# EAGLE schematic Comms (EAGLE 9.6.2), part 1 of 2
DESIGNER: Bradley L. Davis; PART_NUMBER: 68-0003; PROJECT: CougSat-1: Comms; REV: 1.2.0
Assembly variants: Main

## Sheet 1 of 14
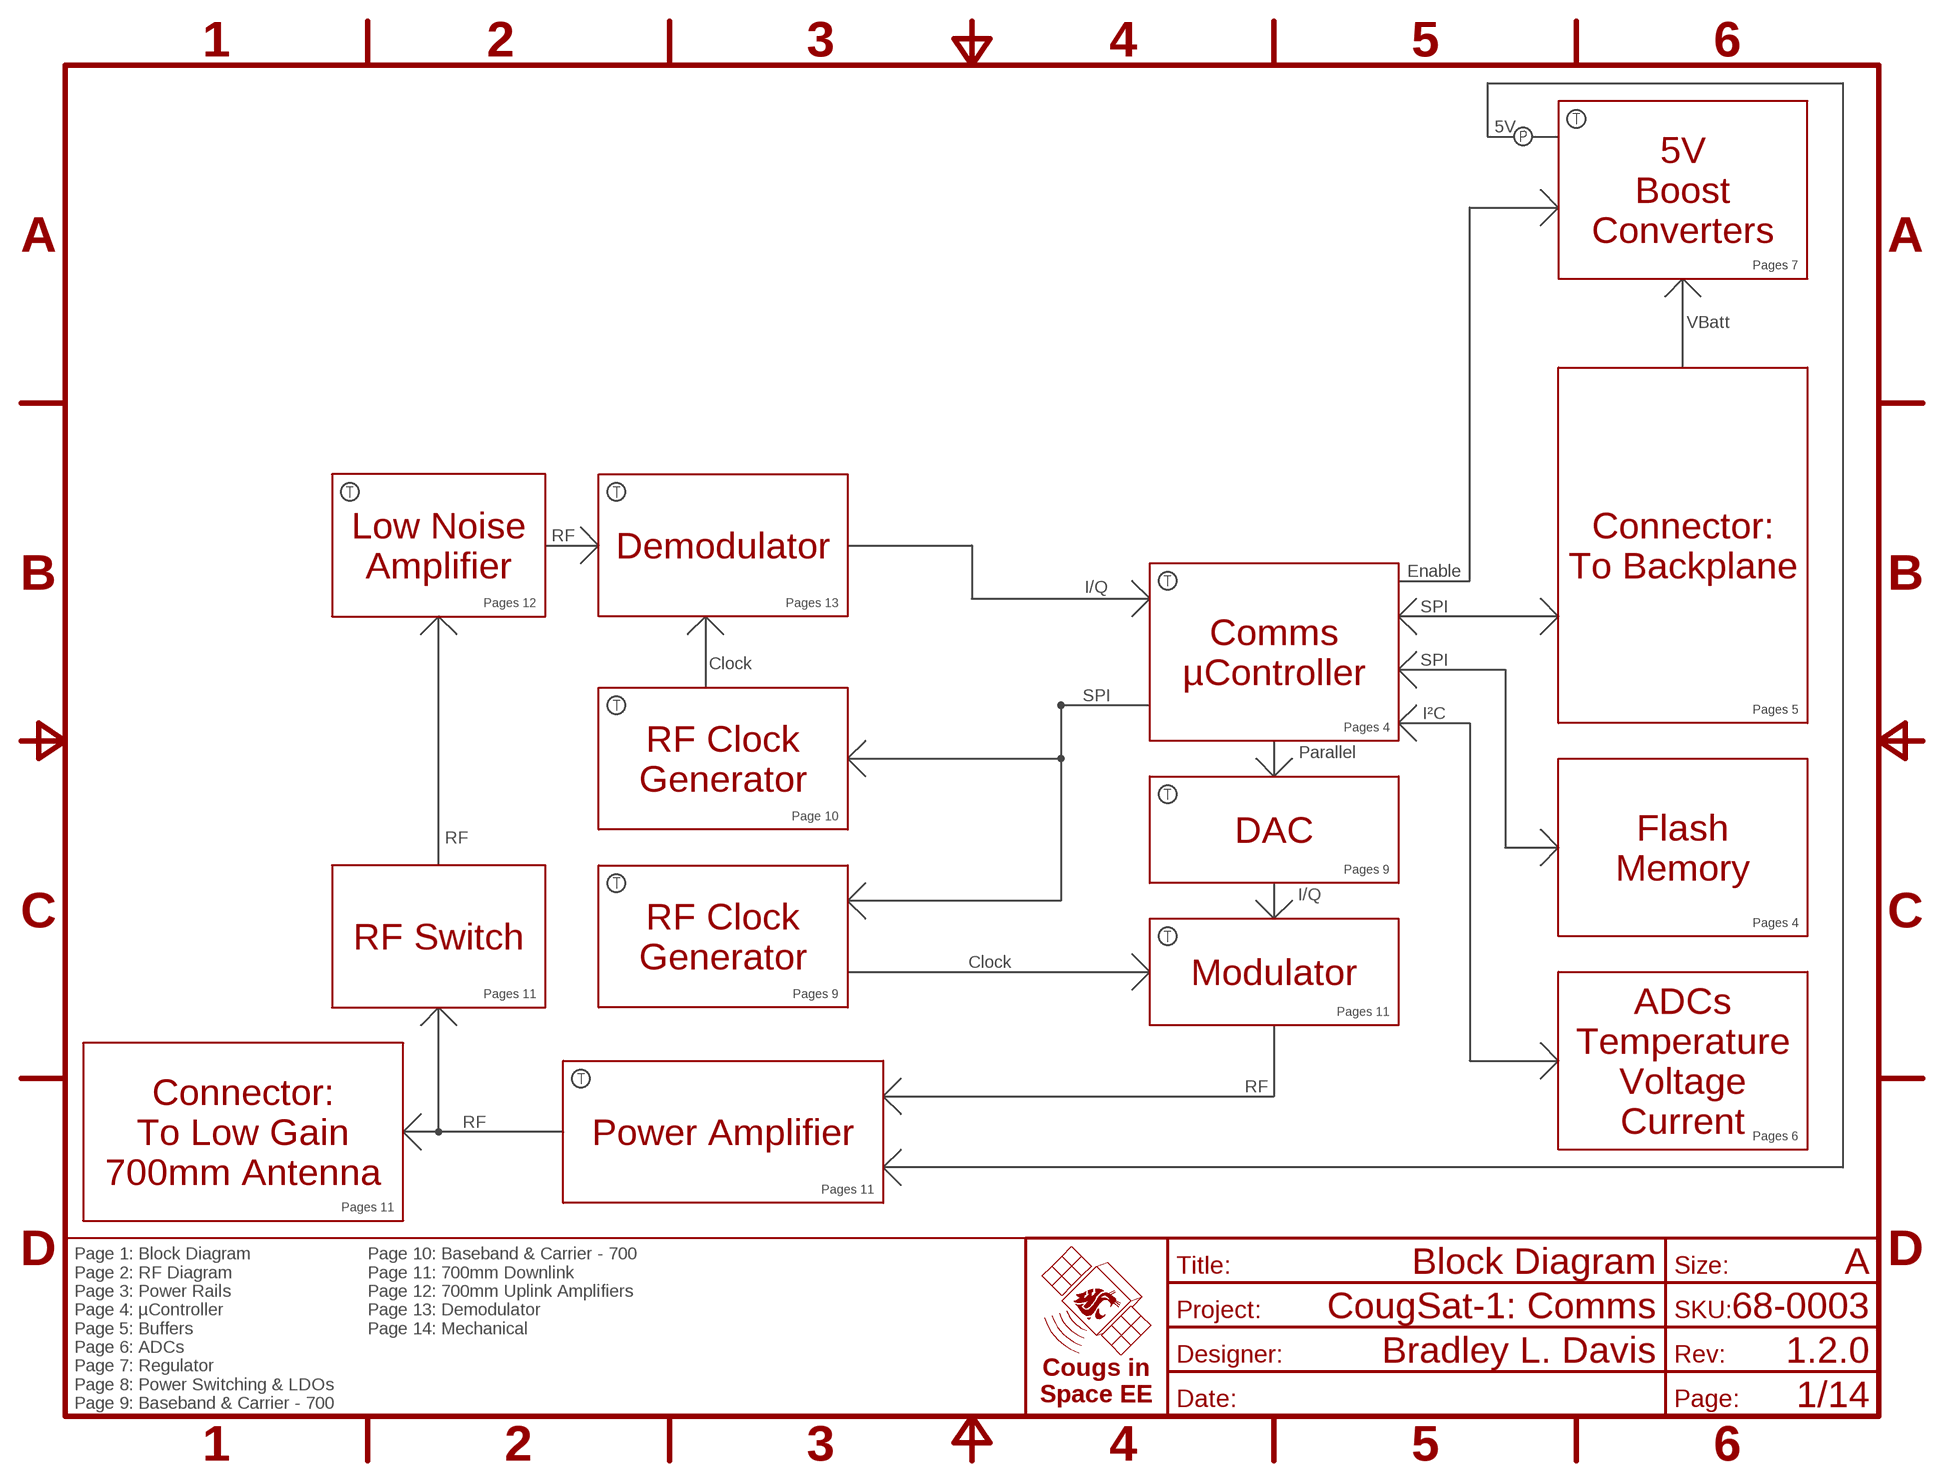
[diagram p0: schematic, sheet 1]
FRAME1 (FRAME-A): TITLE: Block Diagram

### Notes on the sheet
- 5V
- 5V
  Boost
  Converters
- Pages 7
- VBatt
- RF
- Low Noise
  Amplifier
- Demodulator
- Connector:
  To Backplane
- Enable
- I/Q
- Pages 12 | Pages 13
- SPI
- Comms
  µController
- Clock | SPI
- SPI
- Pages 5
- I²C
- Pages 4
- RF Clock
  Generator
- Parallel
- Page 10
- DAC
- RF
- Flash
  Memory
- Pages 9
- I/Q
- Pages 4
- RF Switch
- RF Clock
  Generator
- Clock | Modulator
- Pages 11 | Pages 9
- Pages 11
- ADCs
  Temperature
  Voltage
  Current
- RF
- RF
- Connector:
  To Low Gain
  700mm Antenna
- Power Amplifier
- Pages 6
- Pages 11
- Pages 11
- Page 1: Block Diagram
  Page 2: RF Diagram
  Page 3: Power Rails
  Page 4: µController
  Page 5: Buffers
  Page 6: ADCs
  Page 7: Regulator
  Page 8: Power Switching & LDOs
  Page 9: Baseband & Carrier - 700
- Page 10: Baseband & Carrier - 700
  Page 11: 700mm Downlink
  Page 12: 700mm Uplink Amplifiers
  Page 13: Demodulator
  Page 14: Mechanical

## Sheet 2 of 14
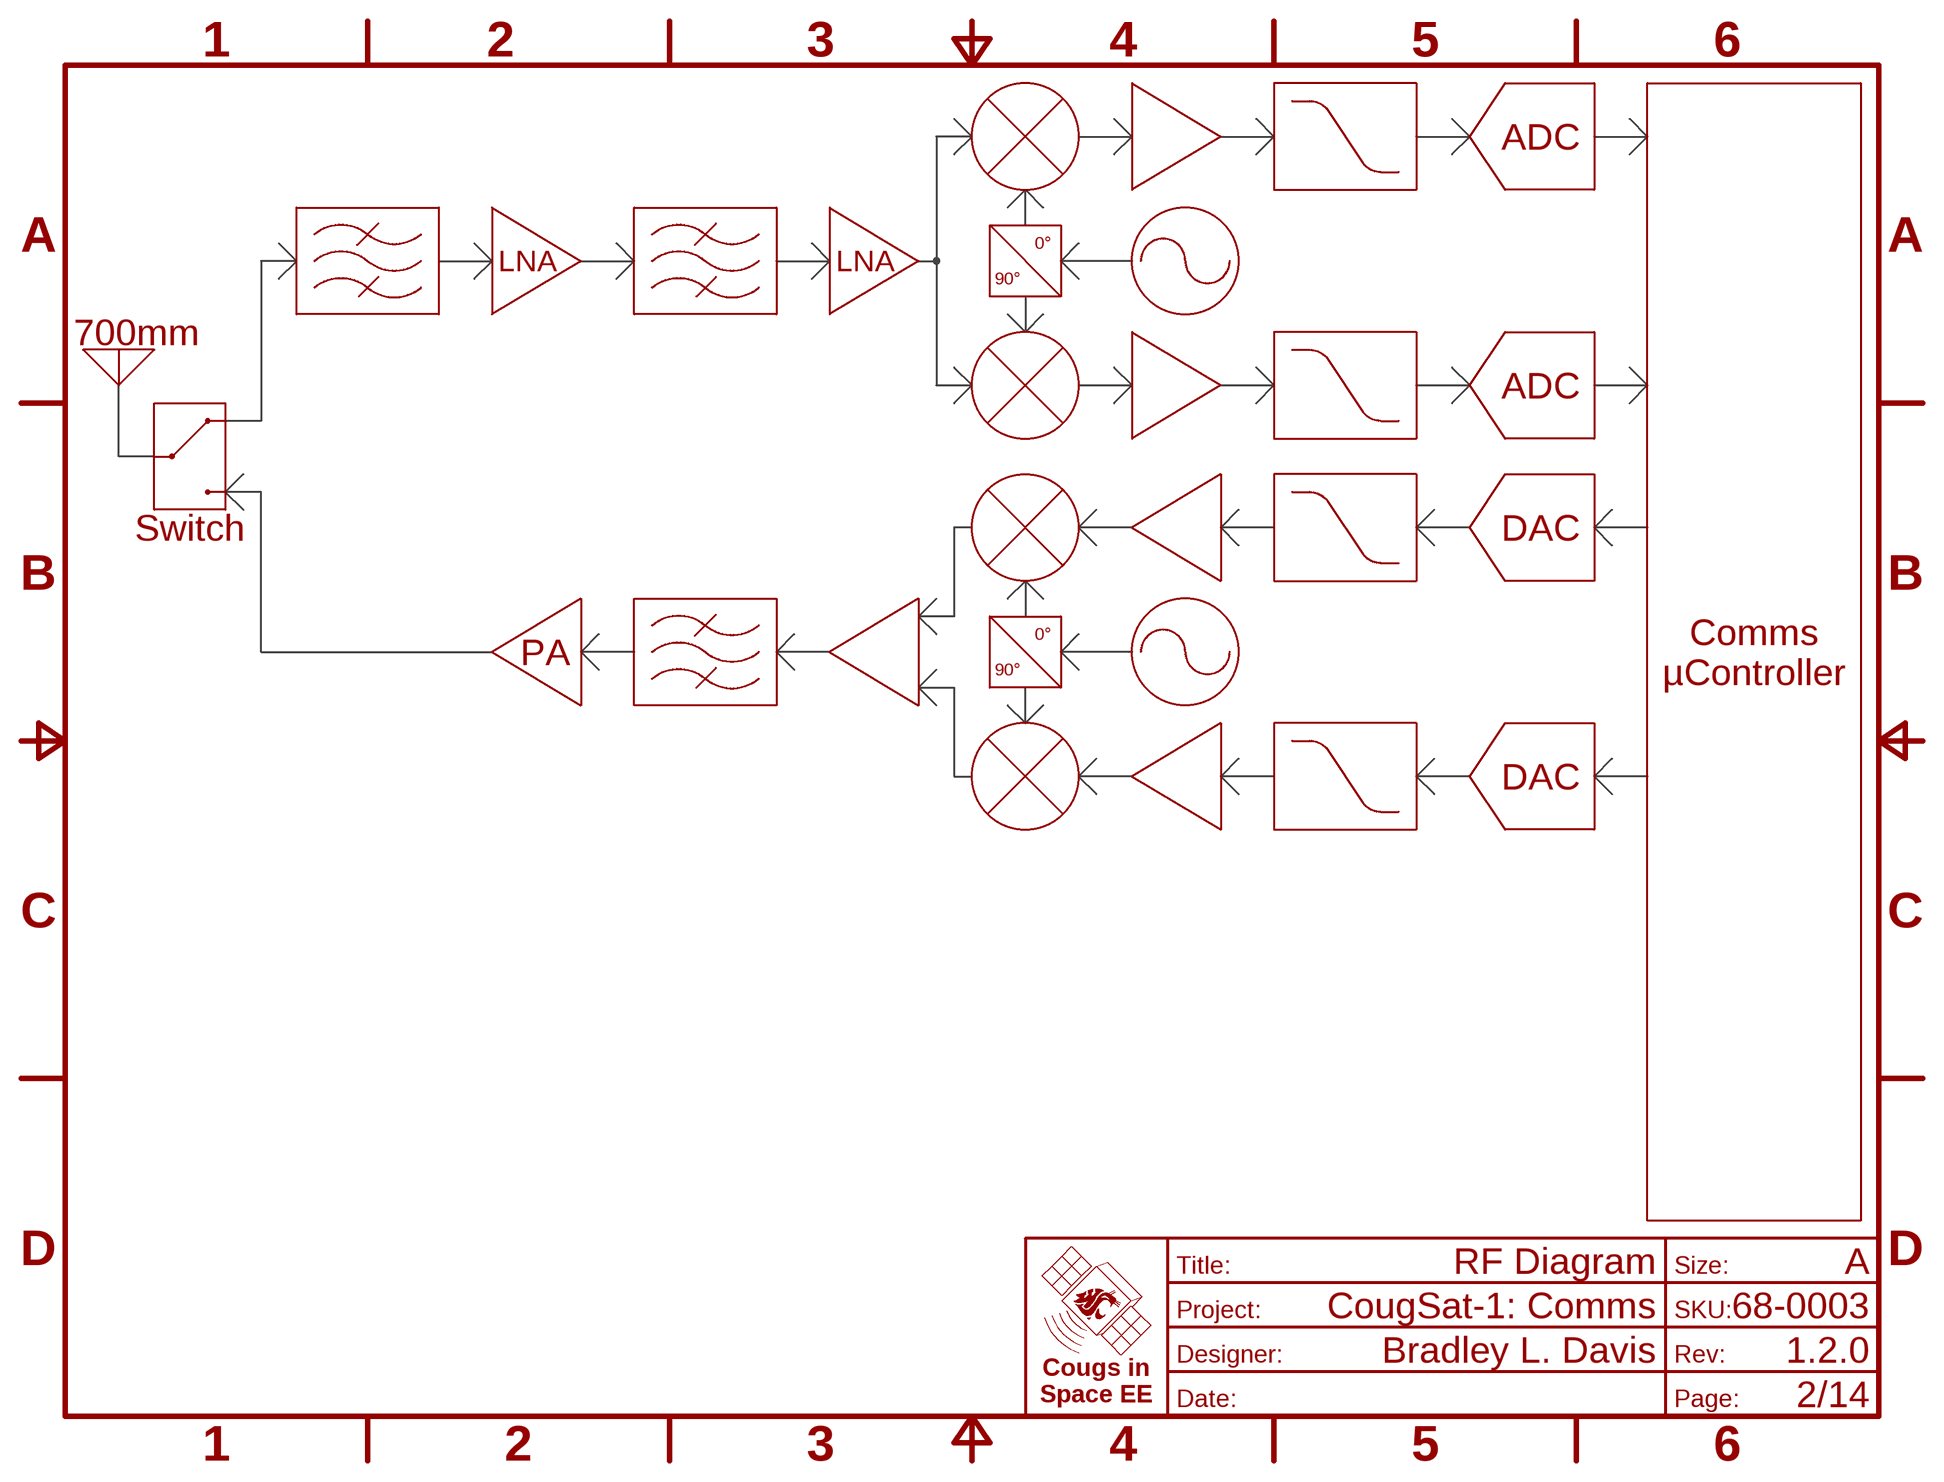
[diagram p1: schematic, sheet 2]
FRAME2 (FRAME-A): TITLE: RF Diagram

### Notes on the sheet
- ADC
- 0°
- LNA | LNA
- 90°
- 700mm
- ADC
- Switch | DAC
- 0°
- PA
- Comms
  µController
- 90°
- DAC

## Sheet 3 of 14
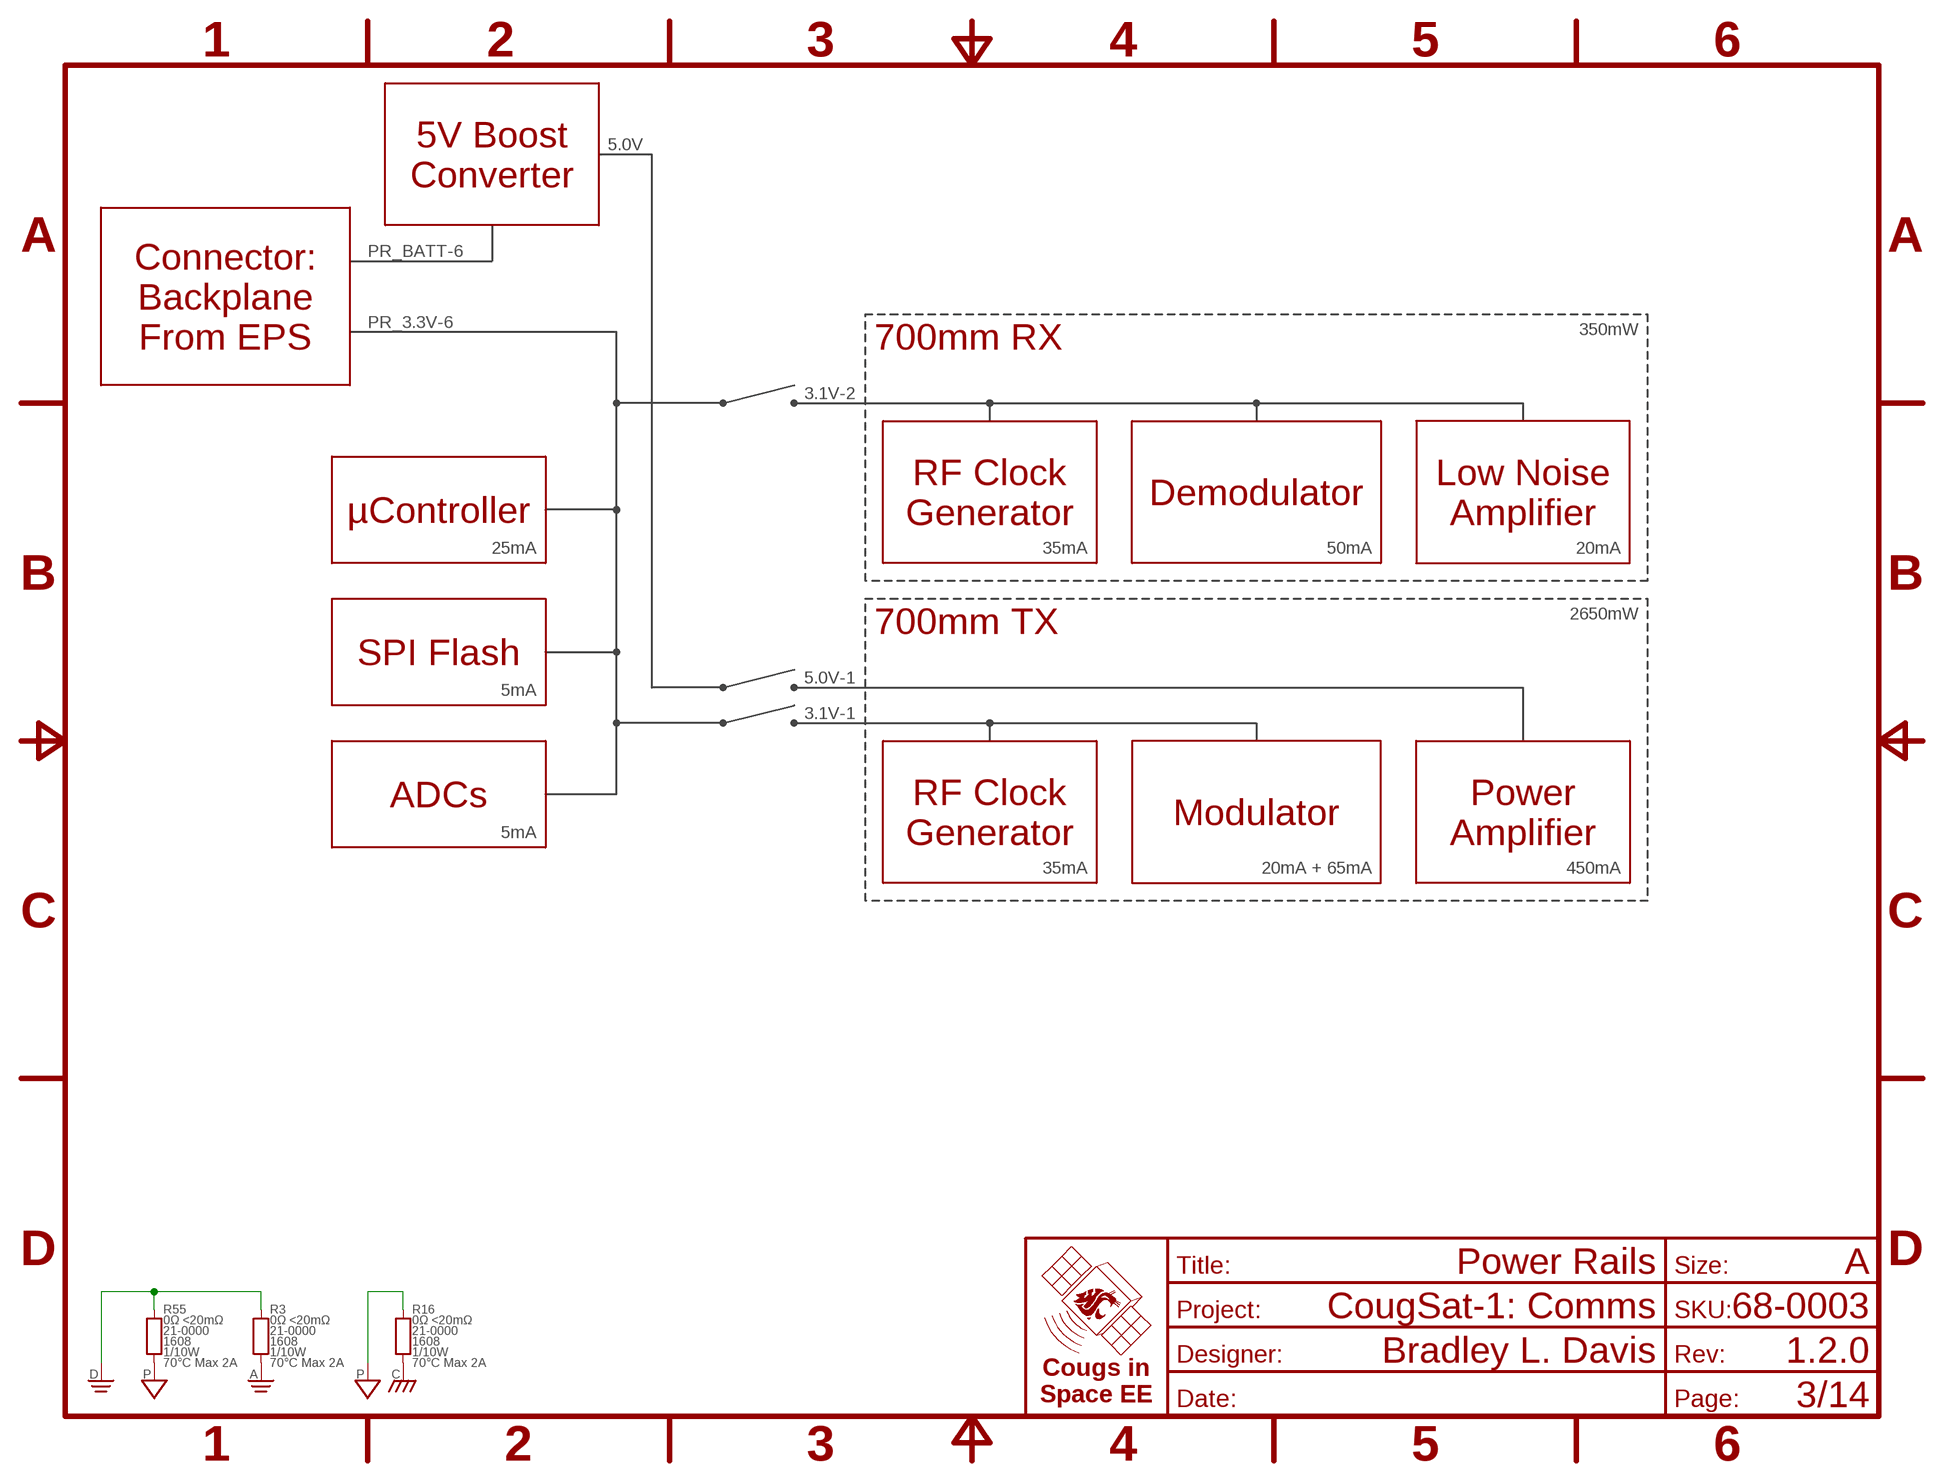
[diagram p2: schematic, sheet 3]
FRAME3 (FRAME-A): TITLE: Power Rails

### Parts
R3  0Ω <20mΩ  RES-V-0-1608  [1608]
R16  0Ω <20mΩ  RES-V-0-1608  [1608]
R55  0Ω <20mΩ  RES-V-0-1608  [1608]

### Nets
AGND [AGND]: R3.1 ; also sheet 4,6,7,8,9,10,11,12,13
CHASSIS [Supplies]: R16.1 ; also sheet 5
DGND [Supplies]: R3.2 R55.2 ; also sheet 4,5,6,7,8,9,10,11,12,13,14
PGND [Supplies]: R16.2 R55.1 ; also sheet 5,7

### Notes on the sheet
- 5.0V
- 5V Boost
  Converter
- PR_BATT-6
- Connector:
  Backplane
  From EPS
- 700mm RX | 350mW
- PR_3.3V-6
- 3.1V-2
- RF Clock
  Generator
- Demodulator
- Low Noise
  Amplifier
- µController
- 25mA | 35mA | 50mA | 20mA
- 700mm TX | 2650mW
- SPI Flash
- 5.0V-1
- 5mA
- 3.1V-1
- ADCs
- RF Clock
  Generator
- Modulator
- Power
  Amplifier
- 5mA
- 35mA | 20mA + 65mA | 450mA

## Sheet 4 of 14
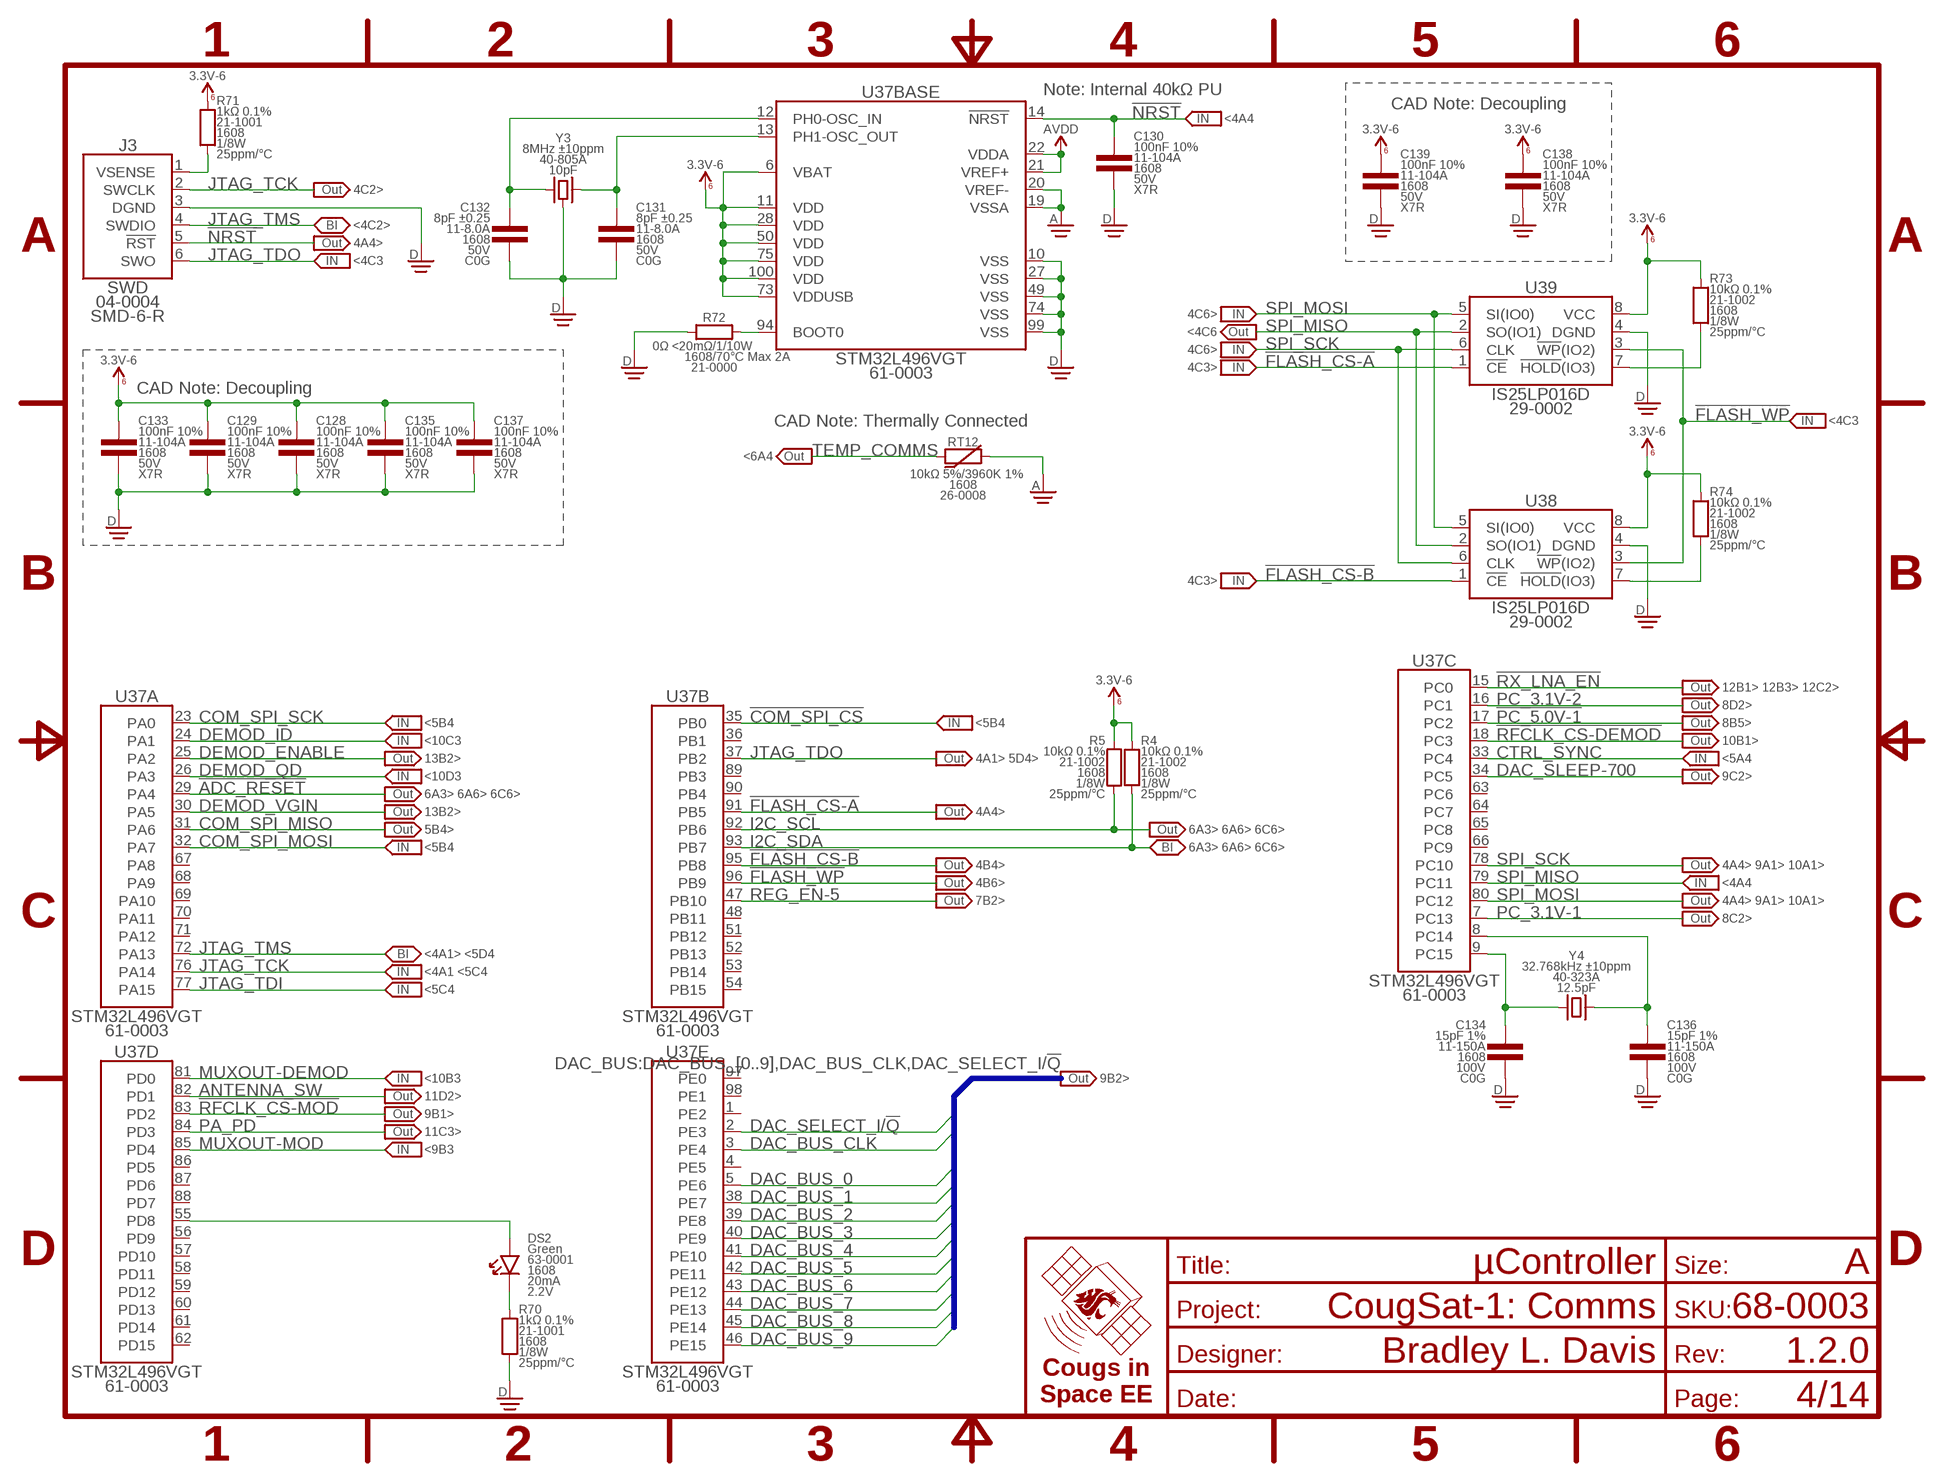
[diagram p3: schematic, sheet 4]
FRAME4 (FRAME-A): TITLE: µController

### Parts
C128  100nF 10%  CAP-V-100NF-1608  [1608]
C129  100nF 10%  CAP-V-100NF-1608  [1608]
C130  100nF 10%  CAP-V-100NF-1608  [1608]
C131  8pF ±0.25  CAP-V-8PF-1608  [1608]
C132  8pF ±0.25  CAP-V-8PF-1608  [1608]
C133  100nF 10%  CAP-V-100NF-1608  [1608]
C134  15pF 1%  CAP-V-15PF-1608  [1608]
C135  100nF 10%  CAP-V-100NF-1608  [1608]
C136  15pF 1%  CAP-V-15PF-1608  [1608]
C137  100nF 10%  CAP-V-100NF-1608  [1608]
C138  100nF 10%  CAP-V-100NF-1608  [1608]
C139  100nF 10%  CAP-V-100NF-1608  [1608]
DS2  Green  LED-V-GRN-1608  [1608-POL]
J3  SWD  SWDSMD-6-R  [SMD2.54-1X06-R]
R4  10kΩ 0.1%  RES-V-10K-1608  [1608]
R5  10kΩ 0.1%  RES-V-10K-1608  [1608]
R70  1kΩ 0.1%  RES-V-1K-1608  [1608]
R71  1kΩ 0.1%  RES-V-1K-1608  [1608]
R72  0Ω <20mΩ  RES-H-0-1608  [1608]
R73  10kΩ 0.1%  RES-V-10K-1608  [1608]
R74  10kΩ 0.1%  RES-V-10K-1608  [1608]
RT12  10kΩ 5%  THERMISTOR-H-10K-1608  [1608]
U37  STM32L496VGT  STM32-100P-L496VGT  [QFP-100-1414]
U38  IS25LP016D  FLASH-(Q)SPI-2MB-SO8  [SO8]
U39  IS25LP016D  FLASH-(Q)SPI-2MB-SO8  [SO8]
Y3  8MHz ±10ppm  CRYSTAL-GROUNDED-8M-SMD-5032  [SMD-5032]
Y4  32.768kHz ±10ppm  CRYSTAL-32.768K-SMD-3215  [SMD-3215]

### Nets
3.3V_6 [Supplies]: C128.1 C129.1 C133.1 C135.1 C137.1 C138.1 C139.1 R4.2 R5.2 R71.2 R73.2 R74.2 U37.6(BASE:VBAT) U37.11(BASE:VDD) U37.28(BASE:VDD) U37.50(BASE:VDD) U37.73(BASE:VDDUSB) U37.75(BASE:VDD) U37.100(BASE:VDD) U38.8(VCC) U39.8(VCC) ; supply symbol labelled 3.3V-6 ; also sheet 5,6,8,9,10
!ADC_RESET: U37.29(A:PA4) ; also sheet 6
!COM_SPI_CS: U37.35(B:PB0) ; also sheet 5
!FLASH_CS-A: U37.91(B:PB5) U39.1(!CE)
!FLASH_CS-B: U37.95(B:PB8) U38.1(!CE)
!FLASH_WP: U37.96(B:PB9) U38.3(!WP!(IO2)) U39.3(!WP!(IO2))
!NRST: C130.1 J3.5(!RST) U37.14(BASE:!NRST)
!PC_5.0V-1: U37.17(C:PC2) ; also sheet 8
!RFCLK_CS-DEMOD: U37.18(C:PC3) ; also sheet 10
!RFCLK_CS-MOD: U37.83(D:PD2) ; also sheet 9
!RX_LNA_EN: U37.15(C:PC0) ; also sheet 12
AGND [AGND]: RT12.2 U37.19(BASE:VSSA) U37.20(BASE:VREF-) ; also sheet 3,6,7,8,9,10,11,12,13
ANTENNA_SW: U37.82(D:PD1) ; also sheet 11
AVDD [AGND]: U37.21(BASE:VREF+) U37.22(BASE:VDDA) ; also sheet 6,7,8,10,11
BOOT0: R72.2 U37.94(BASE:BOOT0)
COM_SPI_MISO: U37.31(A:PA6) ; also sheet 5
COM_SPI_MOSI: U37.32(A:PA7) ; also sheet 5
COM_SPI_SCK: U37.23(A:PA0) ; also sheet 5
CTRL_SYNC: U37.33(C:PC4) ; also sheet 5
DAC_BUS_0: U37.5(E:PE6) ; also sheet 9
DAC_BUS_1: U37.38(E:PE7) ; also sheet 9
DAC_BUS_2: U37.39(E:PE8) ; also sheet 9
DAC_BUS_3: U37.40(E:PE9) ; also sheet 9
DAC_BUS_4: U37.41(E:PE10) ; also sheet 9
DAC_BUS_5: U37.42(E:PE11) ; also sheet 9
DAC_BUS_6: U37.43(E:PE12) ; also sheet 9
DAC_BUS_7: U37.44(E:PE13) ; also sheet 9
DAC_BUS_8: U37.45(E:PE14) ; also sheet 9
DAC_BUS_9: U37.46(E:PE15) ; also sheet 9
DAC_BUS_CLK: U37.3(E:PE4) ; also sheet 9
DAC_SELECT_I/!Q: U37.2(E:PE3) ; also sheet 9
DAC_SLEEP-700: U37.34(C:PC5) ; also sheet 9
DEMOD_ENABLE: U37.25(A:PA2) ; also sheet 13
DEMOD_ID: U37.24(A:PA1) ; also sheet 10
DEMOD_QD: U37.26(A:PA3) ; also sheet 10
DEMOD_VGIN: U37.30(A:PA5) ; also sheet 13
DGND [Supplies]: C128.2 C129.2 C130.2 C131.2 C132.2 C133.2 C134.2 C135.2 C136.2 C137.2 C138.2 C139.2 J3.3(DGND) R70.1 R72.1 U37.10(BASE:VSS) U37.27(BASE:VSS) U37.49(BASE:VSS) U37.74(BASE:VSS) U37.99(BASE:VSS) U38.4(DGND) U39.4(DGND) Y3.2(GND) Y3.4(GND) ; also sheet 3,5,6,7,8,9,10,11,12,13,14
FLASH_HOLD-A: R73.1 U39.7(!HOLD!(IO3))
FLASH_HOLD-B: R74.1 U38.7(!HOLD!(IO3))
I2C_SCL: R5.1 U37.92(B:PB6) ; also sheet 6
I2C_SDA: R4.1 U37.93(B:PB7) ; also sheet 6
JTAG_TCK: J3.2(SWCLK) U37.76(A:PA14) ; also sheet 5
JTAG_TDI: U37.77(A:PA15) ; also sheet 5
JTAG_TDO: J3.6(SWO) U37.37(B:PB2) ; also sheet 5
JTAG_TMS: J3.4(SWDIO) U37.72(A:PA13) ; also sheet 5
LED_A: DS2.A U37.55(D:PD8)
LED_C: DS2.C R70.2
MUXOUT-DEMOD: U37.81(D:PD0) ; also sheet 10
MUXOUT-MOD: U37.85(D:PD4) ; also sheet 9
OSC32_IN: C136.1 U37.8(C:PC14) Y4.2
OSC32_OUT: C134.1 U37.9(C:PC15) Y4.1
OSC_IN: C132.1 U37.12(BASE:PH0-OSC_IN) Y3.1
OSC_OUT: C131.1 U37.13(BASE:PH1-OSC_OUT) Y3.3
PA_PD: U37.84(D:PD3) ; also sheet 11
PC_3.1V-1: U37.7(C:PC13) ; also sheet 8
PC_3.1V-2: U37.16(C:PC1) ; also sheet 8
REG_EN-5: U37.47(B:PB10) ; also sheet 7
SPI_MISO: U37.79(C:PC11) U38.2(SO(IO1)) U39.2(SO(IO1))
SPI_MOSI: U37.80(C:PC12) U38.5(SI(IO0)) U39.5(SI(IO0)) ; also sheet 9,10
SPI_SCK: U37.78(C:PC10) U38.6(CLK) U39.6(CLK) ; also sheet 9,10
SWD_VSENSE: J3.1(VSENSE) R71.1
TEMP_COMMS: RT12.1 ; also sheet 6
Unconnected: U37.1(E:PE2) U37.4(E:PE5) U37.36(B:PB1) U37.48(B:PB11) U37.51(B:PB12) U37.52(B:PB13) U37.53(B:PB14) U37.54(B:PB15) U37.56(D:PD9) U37.57(D:PD10) U37.58(D:PD11) U37.59(D:PD12) U37.60(D:PD13) U37.61(D:PD14) U37.62(D:PD15) U37.63(C:PC6) U37.64(C:PC7) U37.65(C:PC8) U37.66(C:PC9) U37.67(A:PA8) U37.68(A:PA9) U37.69(A:PA10) U37.70(A:PA11) U37.71(A:PA12) U37.86(D:PD5) U37.87(D:PD6) U37.88(D:PD7) U37.89(B:PB3) U37.90(B:PB4) U37.97(E:PE0) U37.98(E:PE1)

### Buses
DAC_BUS:DAC_BUS_[0..9],DAC_BUS_CLK,DAC_SELECT_I/!Q

### Notes on the sheet
- Note: Internal 40kΩ PU
- CAD Note: Decoupling
- <4A4
- 4C2>
- <4C2>
- 4A4>
- <4C3
- 4C6>
- <4C6
- 4C6>
- 4C3>
- CAD Note: Decoupling
- CAD Note: Thermally Connected | <4C3
- <6A4
- 4C3>
- 12B1> 12B3> 12C2>
- 8D2>
- <5B4 | <5B4 | 8B5>
- <10C3 | 10B1>
- 13B2> | 4A1> 5D4> | <5A4
- <10D3 | 9C2>
- 6A3> 6A6> 6C6>
- 13B2> | 4A4>
- 5B4> | 6A3> 6A6> 6C6>
- <5B4 | 6A3> 6A6> 6C6>
- 4B4> | 4A4> 9A1> 10A1>
- 4B6> | <4A4
- 7B2> | 4A4> 9A1> 10A1>
- 8C2>
- <4A1> <5D4
- <4A1 <5C4
- <5C4
- <10B3 | 9B2>
- 11D2>
- 9B1>
- 11C3>
- <9B3

## Sheet 5 of 14
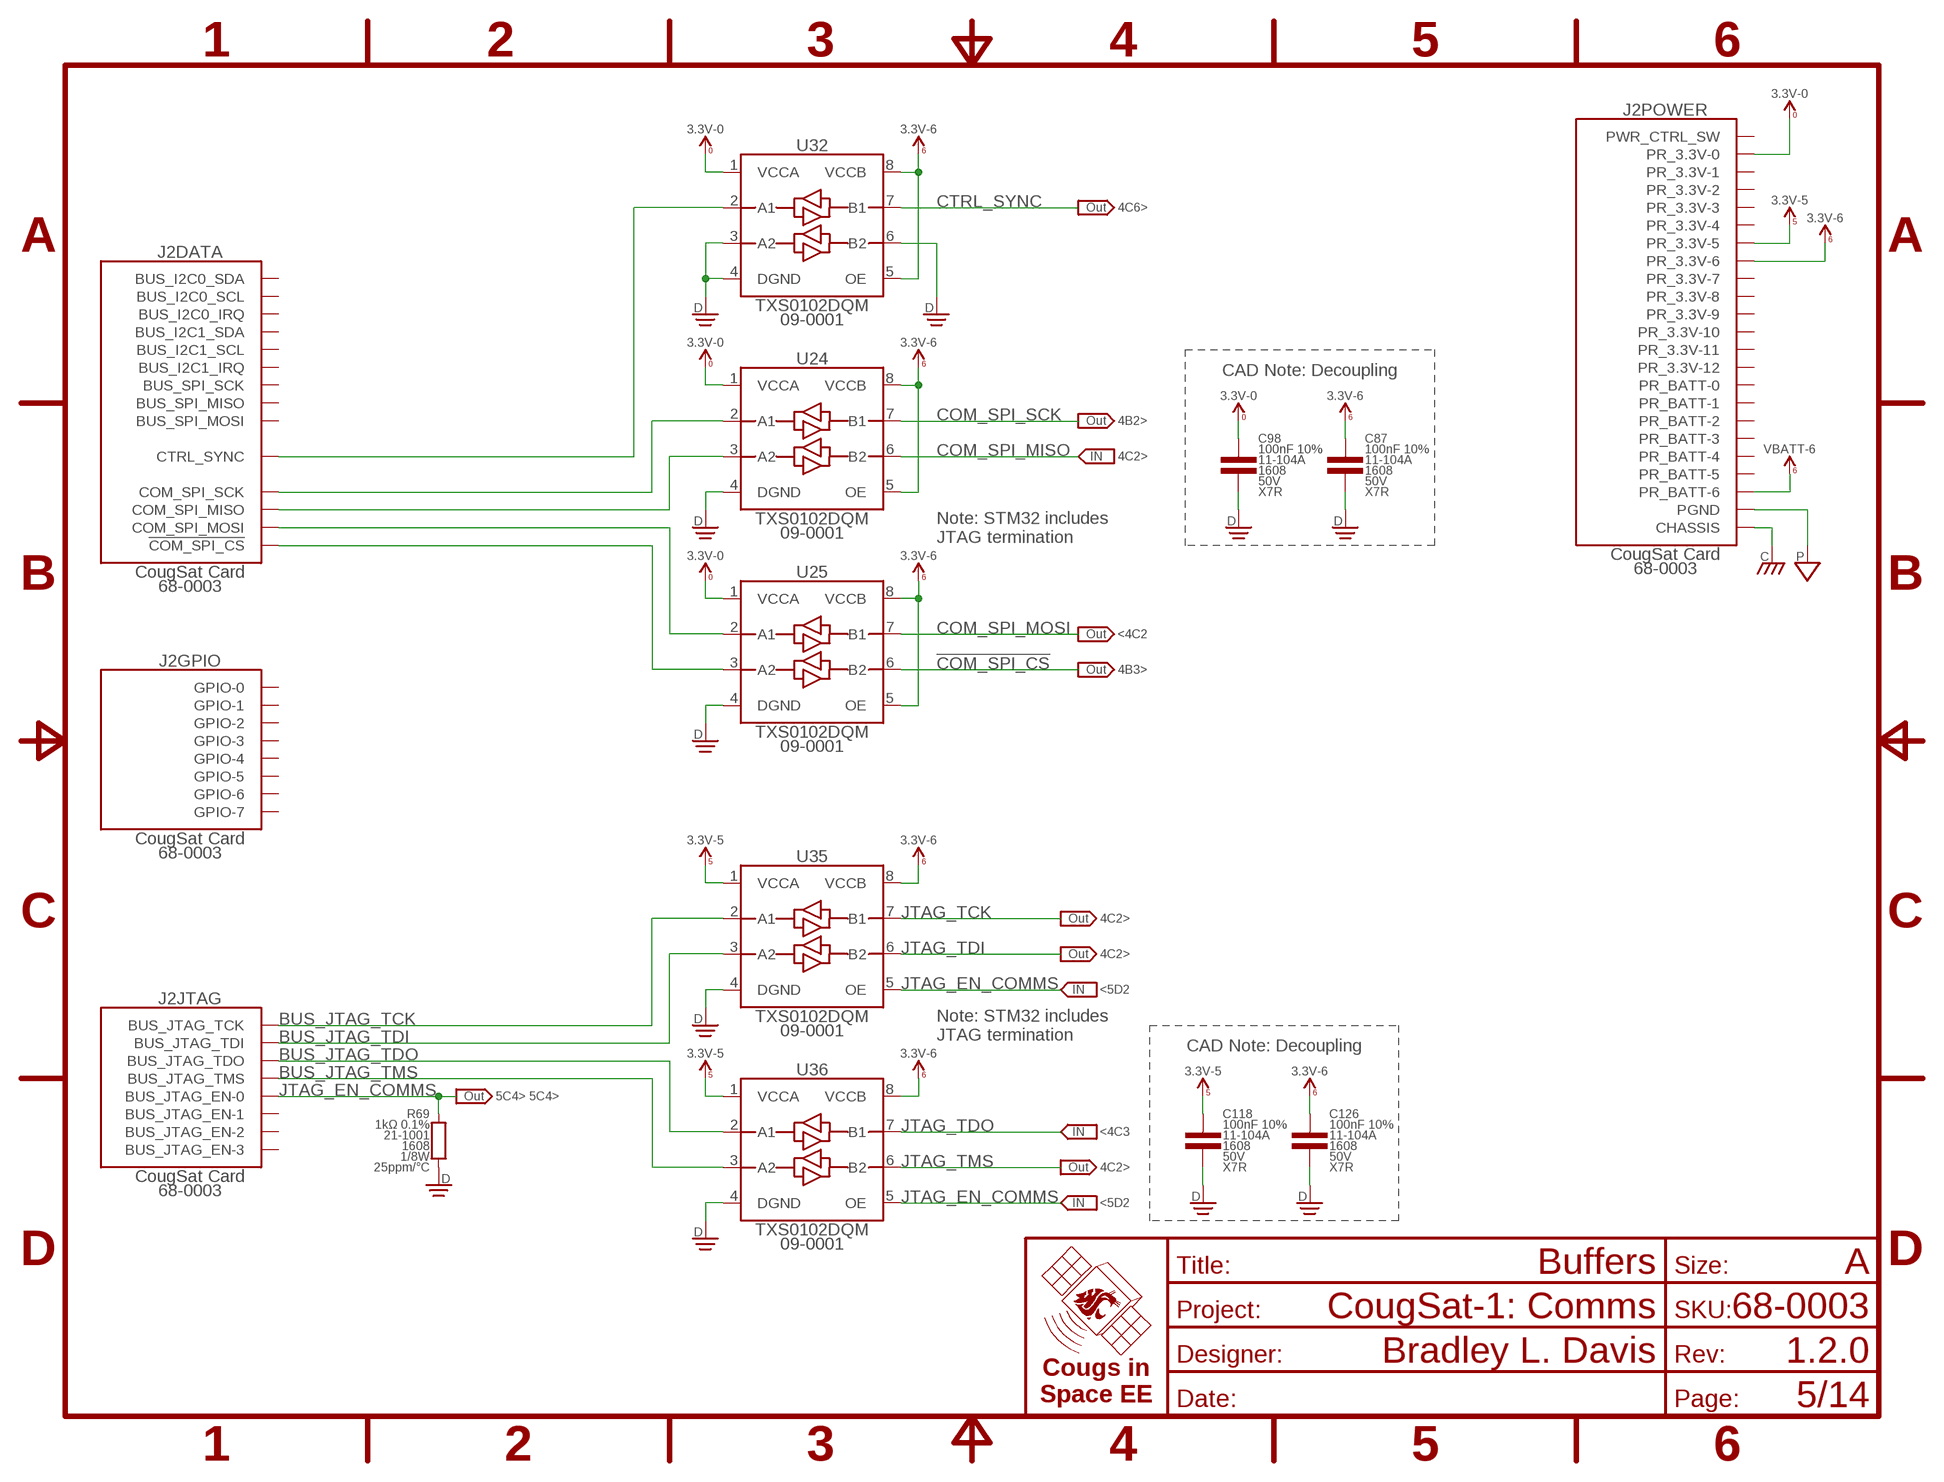
[diagram p4: schematic, sheet 5]
FRAME17 (FRAME-A): TITLE: Buffers

### Parts
C87  100nF 10%  CAP-V-100NF-1608  [1608]
C98  100nF 10%  CAP-V-100NF-1608  [1608]
C118  100nF 10%  CAP-V-100NF-1608  [1608]
C126  100nF 10%  CAP-V-100NF-1608  [1608]
J2  CougSat Card  CIS_CARD-OPEN+X  [CARD-FULL-OPEN+X]
R69  1kΩ 0.1%  RES-V-1K-1608  [1608]
U24  TXS0102DQM  LEVEL_SHIFTER-2BIT-XSON-8  [X2SON-8]
U25  TXS0102DQM  LEVEL_SHIFTER-2BIT-XSON-8  [X2SON-8]
U32  TXS0102DQM  LEVEL_SHIFTER-2BIT-XSON-8  [X2SON-8]
U35  TXS0102DQM  LEVEL_SHIFTER-2BIT-XSON-8  [X2SON-8]
U36  TXS0102DQM  LEVEL_SHIFTER-2BIT-XSON-8  [X2SON-8]

### Nets
3.3V_0: C98.1 J2.A1(POWER:PR_3.3V-0) J2.B1(POWER:PR_3.3V-0) U24.1(VCCA) U25.1(VCCA) U32.1(VCCA) ; supply symbol labelled 3.3V-0
3.3V_5: C118.1 J2.A6(POWER:PR_3.3V-5) J2.B6(POWER:PR_3.3V-5) U35.1(VCCA) U36.1(VCCA) ; supply symbol labelled 3.3V-5
3.3V_6 [Supplies]: C87.1 C126.1 J2.A7(POWER:PR_3.3V-6) J2.B7(POWER:PR_3.3V-6) U24.5(OE) U24.8(VCCB) U25.5(OE) U25.8(VCCB) U32.5(OE) U32.8(VCCB) U35.8(VCCB) U36.8(VCCB) ; supply symbol labelled 3.3V-6 ; also sheet 4,6,8,9,10
!BUS_COM_SPI_CS: J2.A36(DATA:!COM_SPI_CS) J2.B36(DATA:!COM_SPI_CS) U25.3(A2)
!COM_SPI_CS: U25.6(B2) ; also sheet 4
BUS_COM_SPI_MISO: J2.A34(DATA:COM_SPI_MISO) J2.B34(DATA:COM_SPI_MISO) U24.3(A2)
BUS_COM_SPI_MOSI: J2.A35(DATA:COM_SPI_MOSI) J2.B35(DATA:COM_SPI_MOSI) U25.2(A1)
BUS_COM_SPI_SCK: J2.A33(DATA:COM_SPI_SCK) J2.B33(DATA:COM_SPI_SCK) U24.2(A1)
BUS_CTRL_SYNC: J2.A42(DATA:CTRL_SYNC) J2.B42(DATA:CTRL_SYNC) U32.2(A1)
BUS_JTAG_TCK: J2.A46(JTAG:BUS_JTAG_TCK) U35.2(A1)
BUS_JTAG_TDI: J2.A47(JTAG:BUS_JTAG_TDI) U35.3(A2)
BUS_JTAG_TDO: J2.A48(JTAG:BUS_JTAG_TDO) U36.2(A1)
BUS_JTAG_TMS: J2.A49(JTAG:BUS_JTAG_TMS) U36.3(A2)
CHASSIS [Supplies]: J2.CHASSIS@1(POWER:CHASSIS) J2.CHASSIS@2(POWER:CHASSIS) J2.CHASSIS@3(POWER:CHASSIS) J2.CHASSIS@4(POWER:CHASSIS) ; also sheet 3
COM_SPI_MISO: U24.6(B2) ; also sheet 4
COM_SPI_MOSI: U25.7(B1) ; also sheet 4
COM_SPI_SCK: U24.7(B1) ; also sheet 4
CTRL_SYNC: U32.7(B1) ; also sheet 4
DGND [Supplies]: C87.2 C98.2 C118.2 C126.2 R69.1 U24.4(DGND) U25.4(DGND) U32.3(A2) U32.4(DGND) U32.6(B2) U35.4(DGND) U36.4(DGND) ; also sheet 3,4,6,7,8,9,10,11,12,13,14
JTAG_EN_COMMS: J2.B46(JTAG:BUS_JTAG_EN-0) R69.2 U35.5(OE) U36.5(OE)
JTAG_TCK: U35.7(B1) ; also sheet 4
JTAG_TDI: U35.6(B2) ; also sheet 4
JTAG_TDO: U36.7(B1) ; also sheet 4
JTAG_TMS: U36.6(B2) ; also sheet 4
PGND [Supplies]: J2.A21(POWER:PGND) J2.A22(POWER:PGND) J2.A23(POWER:PGND) J2.B21(POWER:PGND) J2.B22(POWER:PGND) J2.B23(POWER:PGND) J2.B24(POWER:PGND) J2.B25(POWER:PGND) J2.B26(POWER:PGND) J2.B27(POWER:PGND) J2.B28(POWER:PGND) J2.B29(POWER:PGND) ; also sheet 3,7
VBATT_6 [Supplies]: J2.A20(POWER:PR_BATT-6) J2.B20(POWER:PR_BATT-6) ; supply symbol labelled VBATT-6 ; also sheet 7
Unconnected: J2.A24(GPIO:GPIO-0) J2.A25(GPIO:GPIO-1) J2.A26(GPIO:GPIO-2) J2.A27(GPIO:GPIO-3) J2.A28(GPIO:GPIO-4) J2.A29(GPIO:GPIO-5) J2.A30(DATA:BUS_I2C1_SDA) J2.A31(DATA:BUS_I2C1_SCL) J2.A32(DATA:BUS_I2C1_IRQ) J2.A37(DATA:BUS_SPI_SCK) J2.A38(DATA:BUS_SPI_MISO) J2.A39(DATA:BUS_SPI_MOSI) J2.A40(POWER:PWR_CTRL_SW) J2.A41(GPIO:GPIO-6) J2.A43(DATA:BUS_I2C0_SDA) J2.A44(DATA:BUS_I2C0_SCL) J2.A45(DATA:BUS_I2C0_IRQ) J2.B30(DATA:BUS_I2C1_SDA) J2.B31(DATA:BUS_I2C1_SCL) J2.B32(DATA:BUS_I2C1_IRQ) J2.B37(DATA:BUS_SPI_SCK) J2.B38(DATA:BUS_SPI_MISO) J2.B39(DATA:BUS_SPI_MOSI) J2.B40(POWER:PWR_CTRL_SW) J2.B41(GPIO:GPIO-7) J2.B43(DATA:BUS_I2C0_SDA) J2.B44(DATA:BUS_I2C0_SCL) J2.B45(DATA:BUS_I2C0_IRQ) J2.B47(JTAG:BUS_JTAG_EN-1) J2.B48(JTAG:BUS_JTAG_EN-2) J2.B49(JTAG:BUS_JTAG_EN-3)

### Notes on the sheet
- 4C6>
- CAD Note: Decoupling
- 4B2>
- 4C2>
- Note: STM32 includes
  JTAG termination
- <4C2
- 4B3>
- 4C2>
- 4C2>
- <5D2
- Note: STM32 includes
  JTAG termination
- CAD Note: Decoupling
- 5C4> 5C4>
- <4C3
- 4C2>
- <5D2

## Sheet 6 of 14
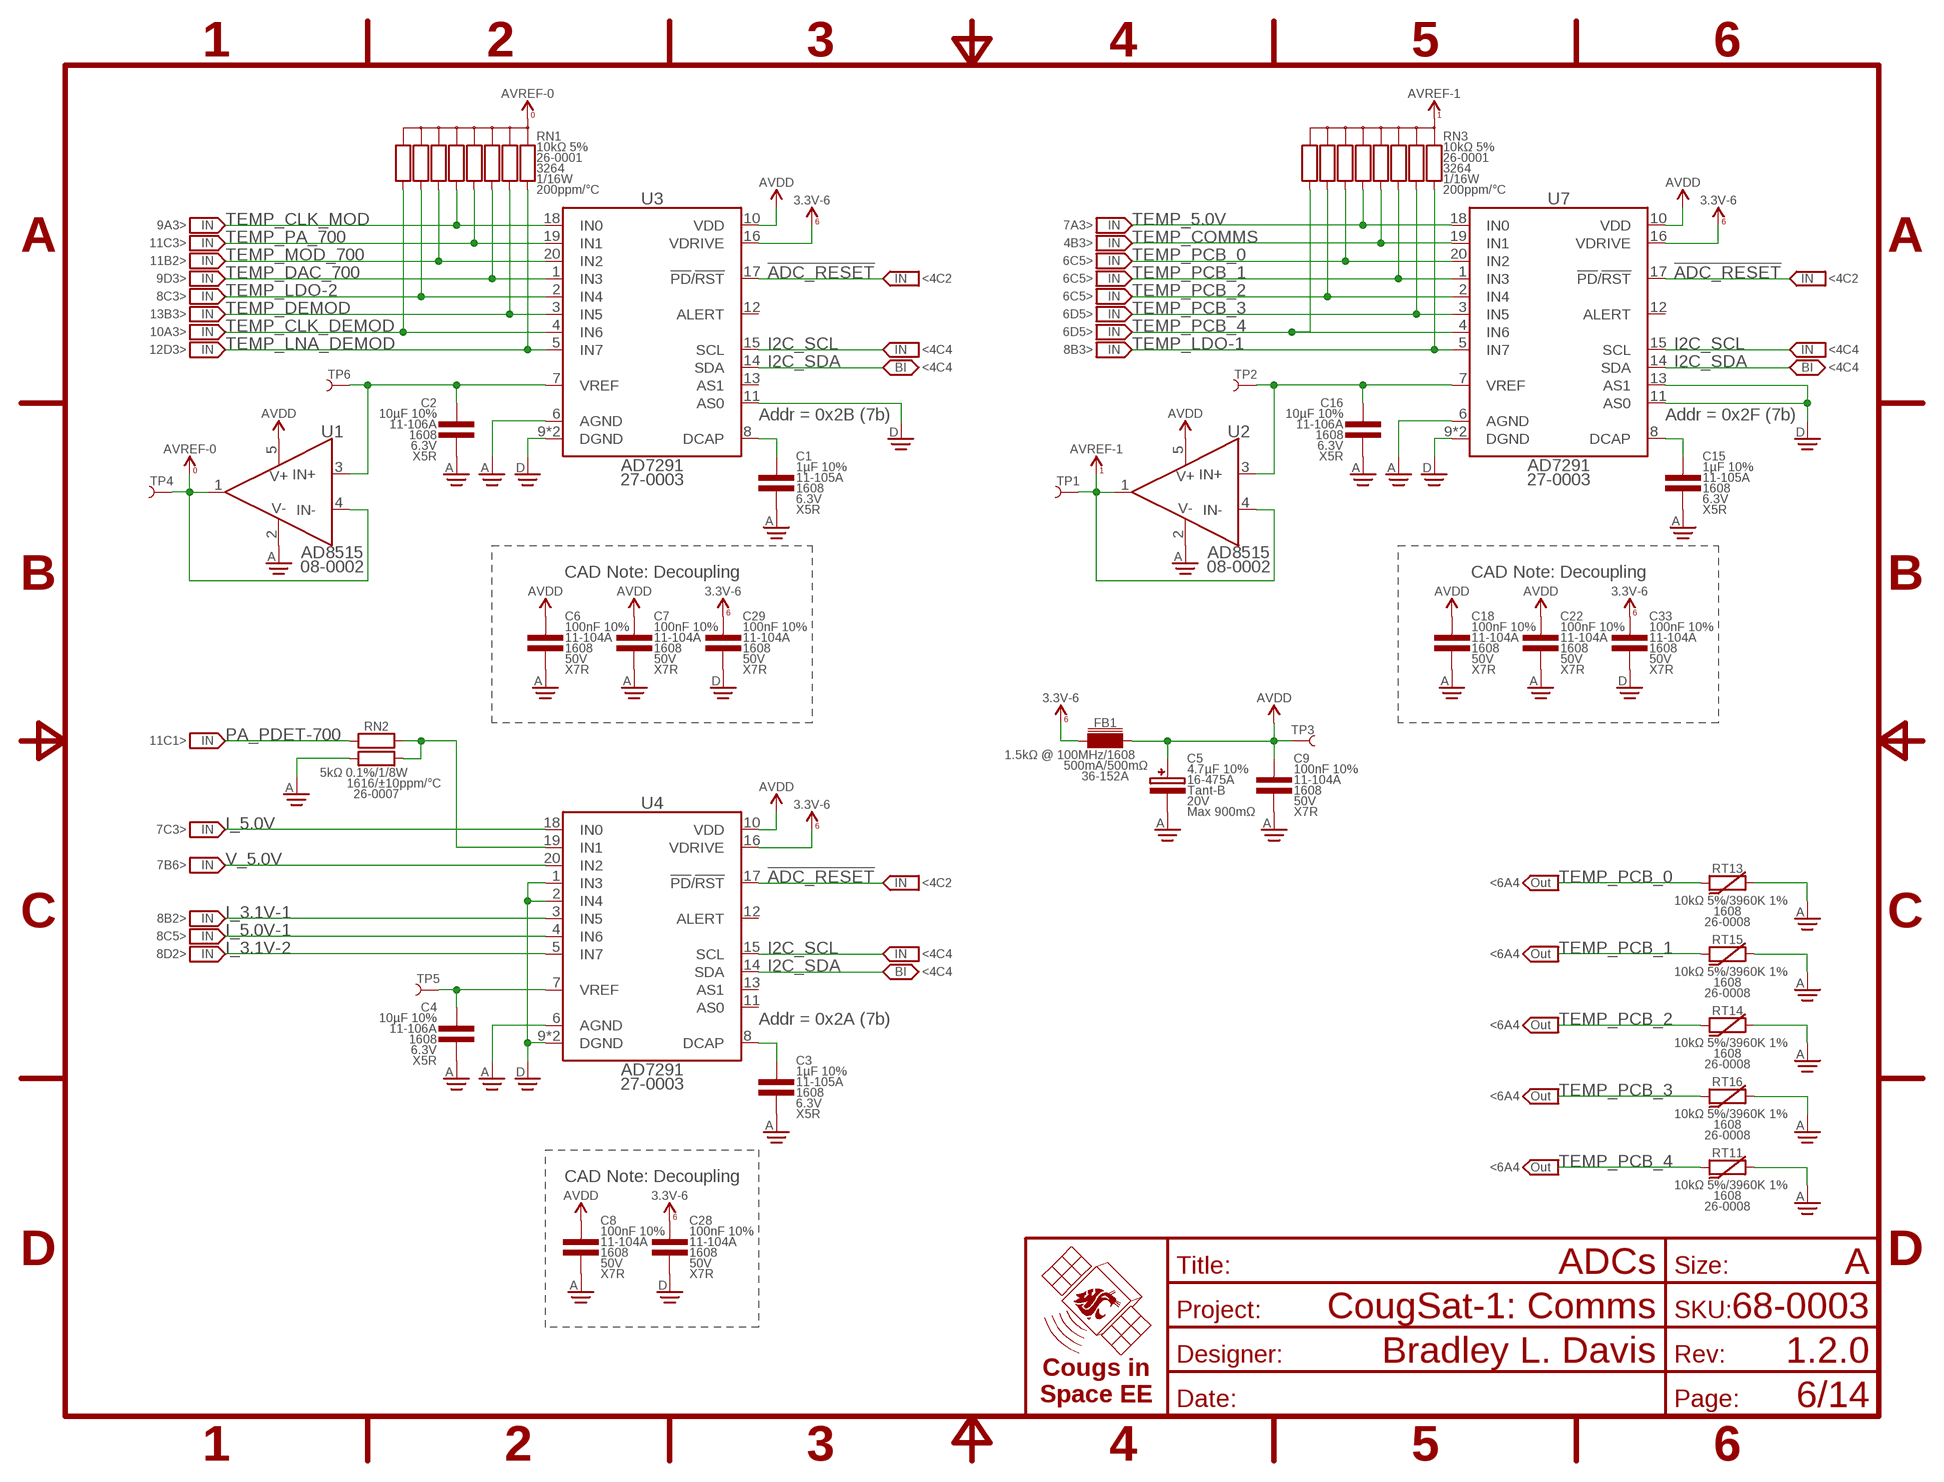
[diagram p5: schematic, sheet 6]
FRAME5 (FRAME-A): TITLE: ADCs

### Parts
C1  1µF 10%  CAP-V-1UF-1608  [1608]
C2  10µF 10%  CAP-V-10UF-1608  [1608]
C3  1µF 10%  CAP-V-1UF-1608  [1608]
C4  10µF 10%  CAP-V-10UF-1608  [1608]
C5  4.7µF 10%  CAP-POL-V-4.7UF-4028  [4028-POL]
C6  100nF 10%  CAP-V-100NF-1608  [1608]
C7  100nF 10%  CAP-V-100NF-1608  [1608]
C8  100nF 10%  CAP-V-100NF-1608  [1608]
C9  100nF 10%  CAP-V-100NF-1608  [1608]
C15  1µF 10%  CAP-V-1UF-1608  [1608]
C16  10µF 10%  CAP-V-10UF-1608  [1608]
C18  100nF 10%  CAP-V-100NF-1608  [1608]
C22  100nF 10%  CAP-V-100NF-1608  [1608]
C28  100nF 10%  CAP-V-100NF-1608  [1608]
C29  100nF 10%  CAP-V-100NF-1608  [1608]
C33  100nF 10%  CAP-V-100NF-1608  [1608]
FB1  1.5kΩ @ 100MHz  CHOKE-H-1.5K-1608  [1608]
RN1  10kΩ 5%  RES_BUS-10-10K-3264  [3264]
RN2  5kΩ 0.1%  RES-H-PAIRED-5K-1616  [1616]
RN3  10kΩ 5%  RES_BUS-10-10K-3264  [3264]
RT11  10kΩ 5%  THERMISTOR-H-10K-1608  [1608]
RT13  10kΩ 5%  THERMISTOR-H-10K-1608  [1608]
RT14  10kΩ 5%  THERMISTOR-H-10K-1608  [1608]
RT15  10kΩ 5%  THERMISTOR-H-10K-1608  [1608]
RT16  10kΩ 5%  THERMISTOR-H-10K-1608  [1608]
TP1  TEST_POINT-SMD-C-1.25  [SMD-C-1.25]
TP2  TEST_POINT-SMD-C-1.25  [SMD-C-1.25]
TP3  TEST_POINT-SMD-C-1.25  [SMD-C-1.25]
TP4  TEST_POINT-SMD-C-1.25  [SMD-C-1.25]
TP5  TEST_POINT-SMD-C-1.25  [SMD-C-1.25]
TP6  TEST_POINT-SMD-C-1.25  [SMD-C-1.25]
U1  AD8515  OPAMP-1-AD8515  [SOT23-5]
U2  AD8515  OPAMP-1-AD8515  [SOT23-5]
U3  AD7291  [QFN-20-4040]
U4  AD7291  [QFN-20-4040]
U7  AD7291  [QFN-20-4040]

### Nets
3.3V_6 [Supplies]: C28.1 C29.1 C33.1 FB1.1 U3.16(VDRIVE) U4.16(VDRIVE) U7.16(VDRIVE) ; supply symbol labelled 3.3V-6 ; also sheet 4,5,8,9,10
!ADC_RESET: U3.17(!PD!/!RST) U4.17(!PD!/!RST) U7.17(!PD!/!RST) ; also sheet 4
ADC_DCAP-0: C1.1 U3.8(DCAP)
ADC_DCAP-1: C15.1 U7.8(DCAP)
ADC_DCAP-2: C3.1 U4.8(DCAP)
ADC_PA_PDET-700: RN2.3(B2) RN2.4(A2) U4.19(IN1)
ADC_VREF-0: C2.1 TP6.1 U1.3(IN+) U3.7(VREF)
ADC_VREF-1: C16.1 TP2.1 U2.3(IN+) U7.7(VREF)
ADC_VREF-2: C4.1 TP5.1 U4.7(VREF)
AGND [AGND]: C1.2 C2.2 C3.2 C4.2 C5.C C6.2 C7.2 C8.2 C9.2 C15.2 C16.2 C18.2 C22.2 RN2.1(A1) RT11.2 RT13.2 RT14.2 RT15.2 RT16.2 U1.2(V-) U2.2(V-) U3.6(AGND) U4.6(AGND) U7.6(AGND) ; also sheet 3,4,7,8,9,10,11,12,13
AVDD [AGND]: C5.A C6.1 C7.1 C8.1 C9.1 C18.1 C22.1 FB1.2 TP3.1 U1.5(V+) U2.5(V+) U3.10(VDD) U4.10(VDD) U7.10(VDD) ; also sheet 4,7,8,10,11
AVREF-0 [AGND]: RN1.5(C) RN1.10(C) TP4.1 U1.1(OUT) U1.4(IN-)
AVREF-1 [AGND]: RN3.5(C) RN3.10(C) TP1.1 U2.1(OUT) U2.4(IN-)
DGND [Supplies]: C28.2 C29.2 C33.2 U3.9(DGND) U3.11(AS0) U3.PAD(DGND) U4.1(IN3) U4.2(IN4) U4.9(DGND) U4.PAD(DGND) U7.9(DGND) U7.11(AS0) U7.13(AS1) U7.PAD(DGND) ; also sheet 3,4,5,7,8,9,10,11,12,13,14
I2C_SCL: U3.15(SCL) U4.15(SCL) U7.15(SCL) ; also sheet 4
I2C_SDA: U3.14(SDA) U4.14(SDA) U7.14(SDA) ; also sheet 4
I_3.1V-1: U4.3(IN5) ; also sheet 8
I_3.1V-2: U4.5(IN7) ; also sheet 8
I_5.0V: U4.18(IN0) ; also sheet 7
I_5.0V-1: U4.4(IN6) ; also sheet 8
PA_PDET-700: RN2.2(B1) ; also sheet 11
TEMP_5.0V: RN3.6 U7.18(IN0) ; also sheet 7
TEMP_CLK_DEMOD: RN1.9 U3.4(IN6) ; also sheet 10
TEMP_CLK_MOD: RN1.6 U3.18(IN0) ; also sheet 9
TEMP_COMMS: RN3.4 U7.19(IN1) ; also sheet 4
TEMP_DAC_700: RN1.3 U3.1(IN3) ; also sheet 9
TEMP_DEMOD: RN1.2 U3.3(IN5) ; also sheet 13
TEMP_LDO-1: RN3.1 U7.5(IN7) ; also sheet 8
TEMP_LDO-2: RN1.8 U3.2(IN4) ; also sheet 8
TEMP_LNA_DEMOD: RN1.1 U3.5(IN7) ; also sheet 12
TEMP_MOD_700: RN1.7 U3.20(IN2) ; also sheet 11
TEMP_PA_700: RN1.4 U3.19(IN1) ; also sheet 11
TEMP_PCB_0: RN3.7 RT13.1 U7.20(IN2)
TEMP_PCB_1: RN3.3 RT15.1 U7.1(IN3)
TEMP_PCB_2: RN3.8 RT14.1 U7.2(IN4)
TEMP_PCB_3: RN3.2 RT16.1 U7.3(IN5)
TEMP_PCB_4: RN3.9 RT11.1 U7.4(IN6)
V_5.0V: U4.20(IN2) ; also sheet 7
Unconnected: U3.12(ALERT) U3.13(AS1) U4.11(AS0) U4.12(ALERT) U4.13(AS1) U7.12(ALERT)

### Notes on the sheet
- 9A3> | 7A3>
- 11C3> | 4B3>
- 11B2> | 6C5>
- 9D3> | <4C2 | 6C5> | <4C2
- 8C3> | 6C5>
- 13B3> | 6D5>
- 10A3> | 6D5>
- 12D3> | <4C4 | 8B3> | <4C4
- <4C4 | <4C4
- Addr = 0x2B (7b) | Addr = 0x2F (7b)
- CAD Note: Decoupling | CAD Note: Decoupling
- 11C1>
- 7C3>
- 7B6>
- <4C2 | <6A4
- 8B2>
- 8C5>
- 8D2> | <4C4 | <6A4
- <4C4
- Addr = 0x2A (7b) | <6A4
- <6A4
- <6A4
- CAD Note: Decoupling

## Sheet 7 of 14
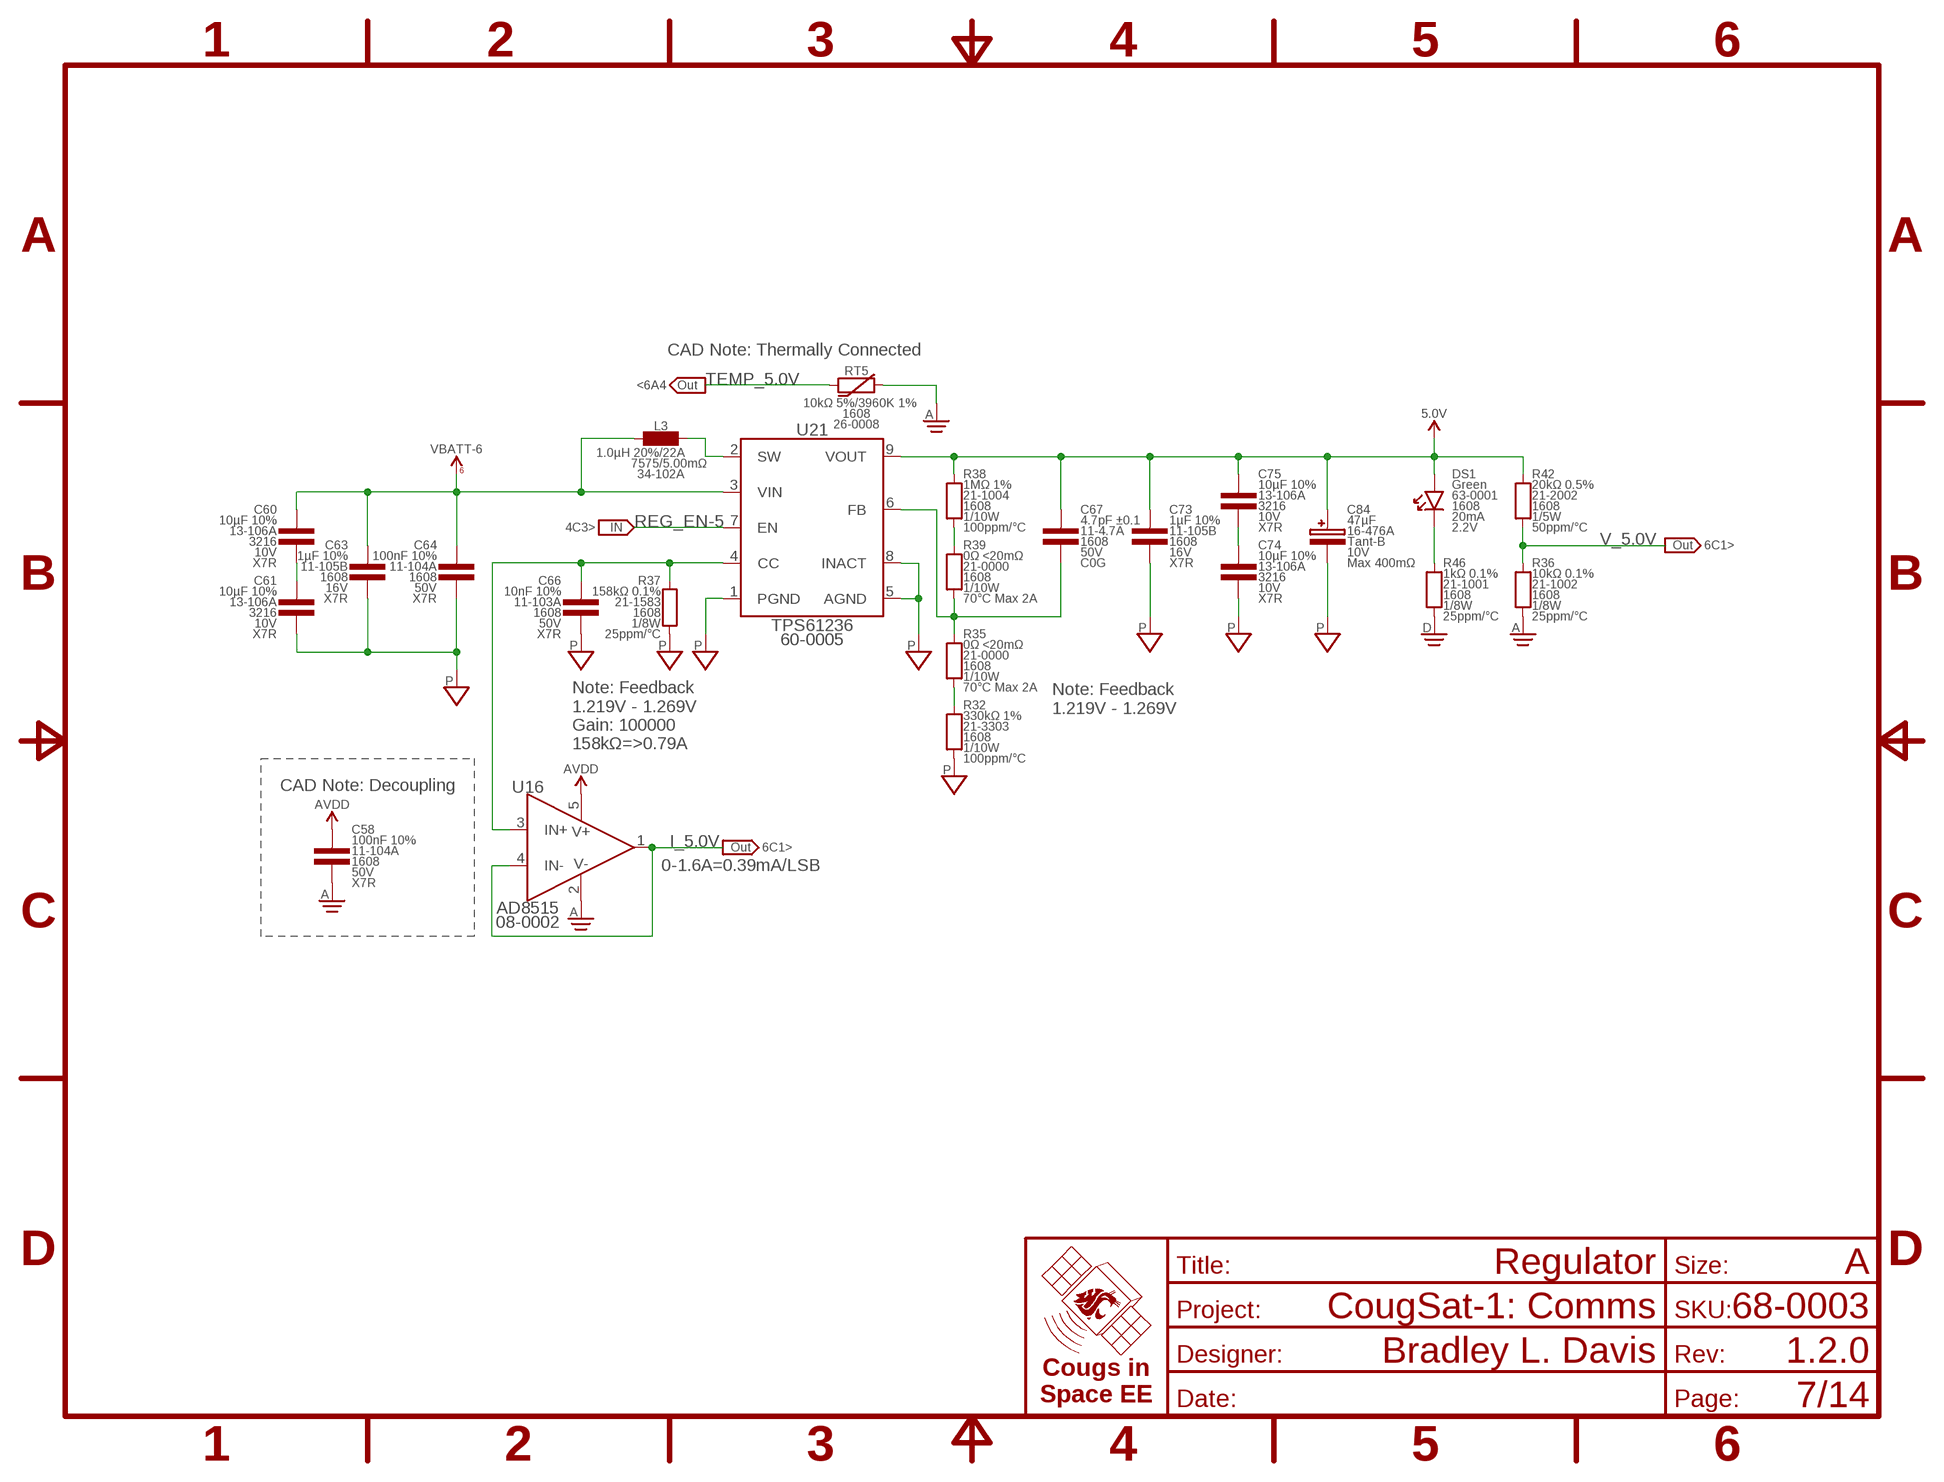
[diagram p6: schematic, sheet 7]
FRAME6 (FRAME-A): TITLE: Regulator

### Parts
C58  100nF 10%  CAP-V-100NF-1608  [1608]
C60  10µF 10%  CAP-V-10UF-3216  [3216]
C61  10µF 10%  CAP-V-10UF-3216  [3216]
C63  1µF 10%  CAP-V-1UF-B-1608  [1608]
C64  100nF 10%  CAP-V-100NF-1608  [1608]
C66  10nF 10%  CAP-V-10NF-1608  [1608]
C67  4.7pF ±0.1  CAP-V-4.7PF-1608  [1608]
C73  1µF 10%  CAP-V-1UF-B-1608  [1608]
C74  10µF 10%  CAP-V-10UF-3216  [3216]
C75  10µF 10%  CAP-V-10UF-3216  [3216]
C84  47µF  CAP-POL-V-47UF-4028  [4028-POL]
DS1  Green  LED-V-GRN-1608  [1608-POL]
L3  1.0µH 20%  INDUCTOR-H-1UH-7575  [7575]
R32  330kΩ 1%  RES-V-330K-1608  [1608]
R35  0Ω <20mΩ  RES-V-0-1608  [1608]
R36  10kΩ 0.1%  RES-V-10K-1608  [1608]
R37  158kΩ 0.1%  RES-V-158K-1608  [1608]
R38  1MΩ 1%  RES-V-1M-1608  [1608]
R39  0Ω <20mΩ  RES-V-0-1608  [1608]
R42  20kΩ 0.5%  RES-V-20K-1608  [1608]
R46  1kΩ 0.1%  RES-V-1K-1608  [1608]
RT5  10kΩ 5%  THERMISTOR-H-10K-1608  [1608]
U16  AD8515  OPAMP-1-AD8515  [SOT23-5]
U21  TPS61236  TPS61236P  [QFN-TPS6123X]

### Nets
5.0V [Supplies]: C67.1 C73.1 C75.1 C84.A DS1.A R38.2 R42.2 U21.9(VOUT) ; also sheet 8,11
AGND [AGND]: C58.2 R36.1 RT5.2 U16.2(V-) ; also sheet 3,4,6,8,9,10,11,12,13
AVDD [AGND]: C58.1 U16.5(V+) ; also sheet 4,6,8,10,11
DGND [Supplies]: R46.1 ; also sheet 3,4,5,6,8,9,10,11,12,13,14
I_5.0V: U16.1(OUT) U16.4(IN-) ; also sheet 6
LED_C-5: DS1.C R46.2
PGND [Supplies]: C61.2 C63.2 C64.2 C66.2 C73.2 C74.2 C84.C R32.1 R37.1 U21.1(PGND) U21.5(AGND) U21.8(INACT) ; also sheet 3,5
REG_CC-5: C66.1 R37.2 U16.3(IN+) U21.4(CC)
REG_CIN-5: C60.2 C61.1
REG_COUT-5: C74.1 C75.2
REG_EN-5: U21.7(EN) ; also sheet 4
REG_FB-5: C67.2 R35.2 R39.1 U21.6(FB)
REG_FB_RES-HIGH-5: R38.1 R39.2
REG_FB_RES-LOW-5: R32.2 R35.1
REG_SW-5 [Supplies]: L3.2 U21.2(SW)
TEMP_5.0V: RT5.1 ; also sheet 6
V_5.0V: R36.2 R42.1 ; also sheet 6
VBATT_6 [Supplies]: C60.1 C63.1 C64.1 L3.1 U21.3(VIN) ; supply symbol labelled VBATT-6 ; also sheet 5

### Notes on the sheet
- CAD Note: Thermally Connected
- <6A4
- 4C3>
- 6C1>
- Note: Feedback
  1.219V - 1.269V
- Note: Feedback
  1.219V - 1.269V
  Gain: 100000
  158kΩ=>0.79A
- CAD Note: Decoupling
- 6C1>
- 0-1.6A=0.39mA/LSB

## Sheet 8 of 14
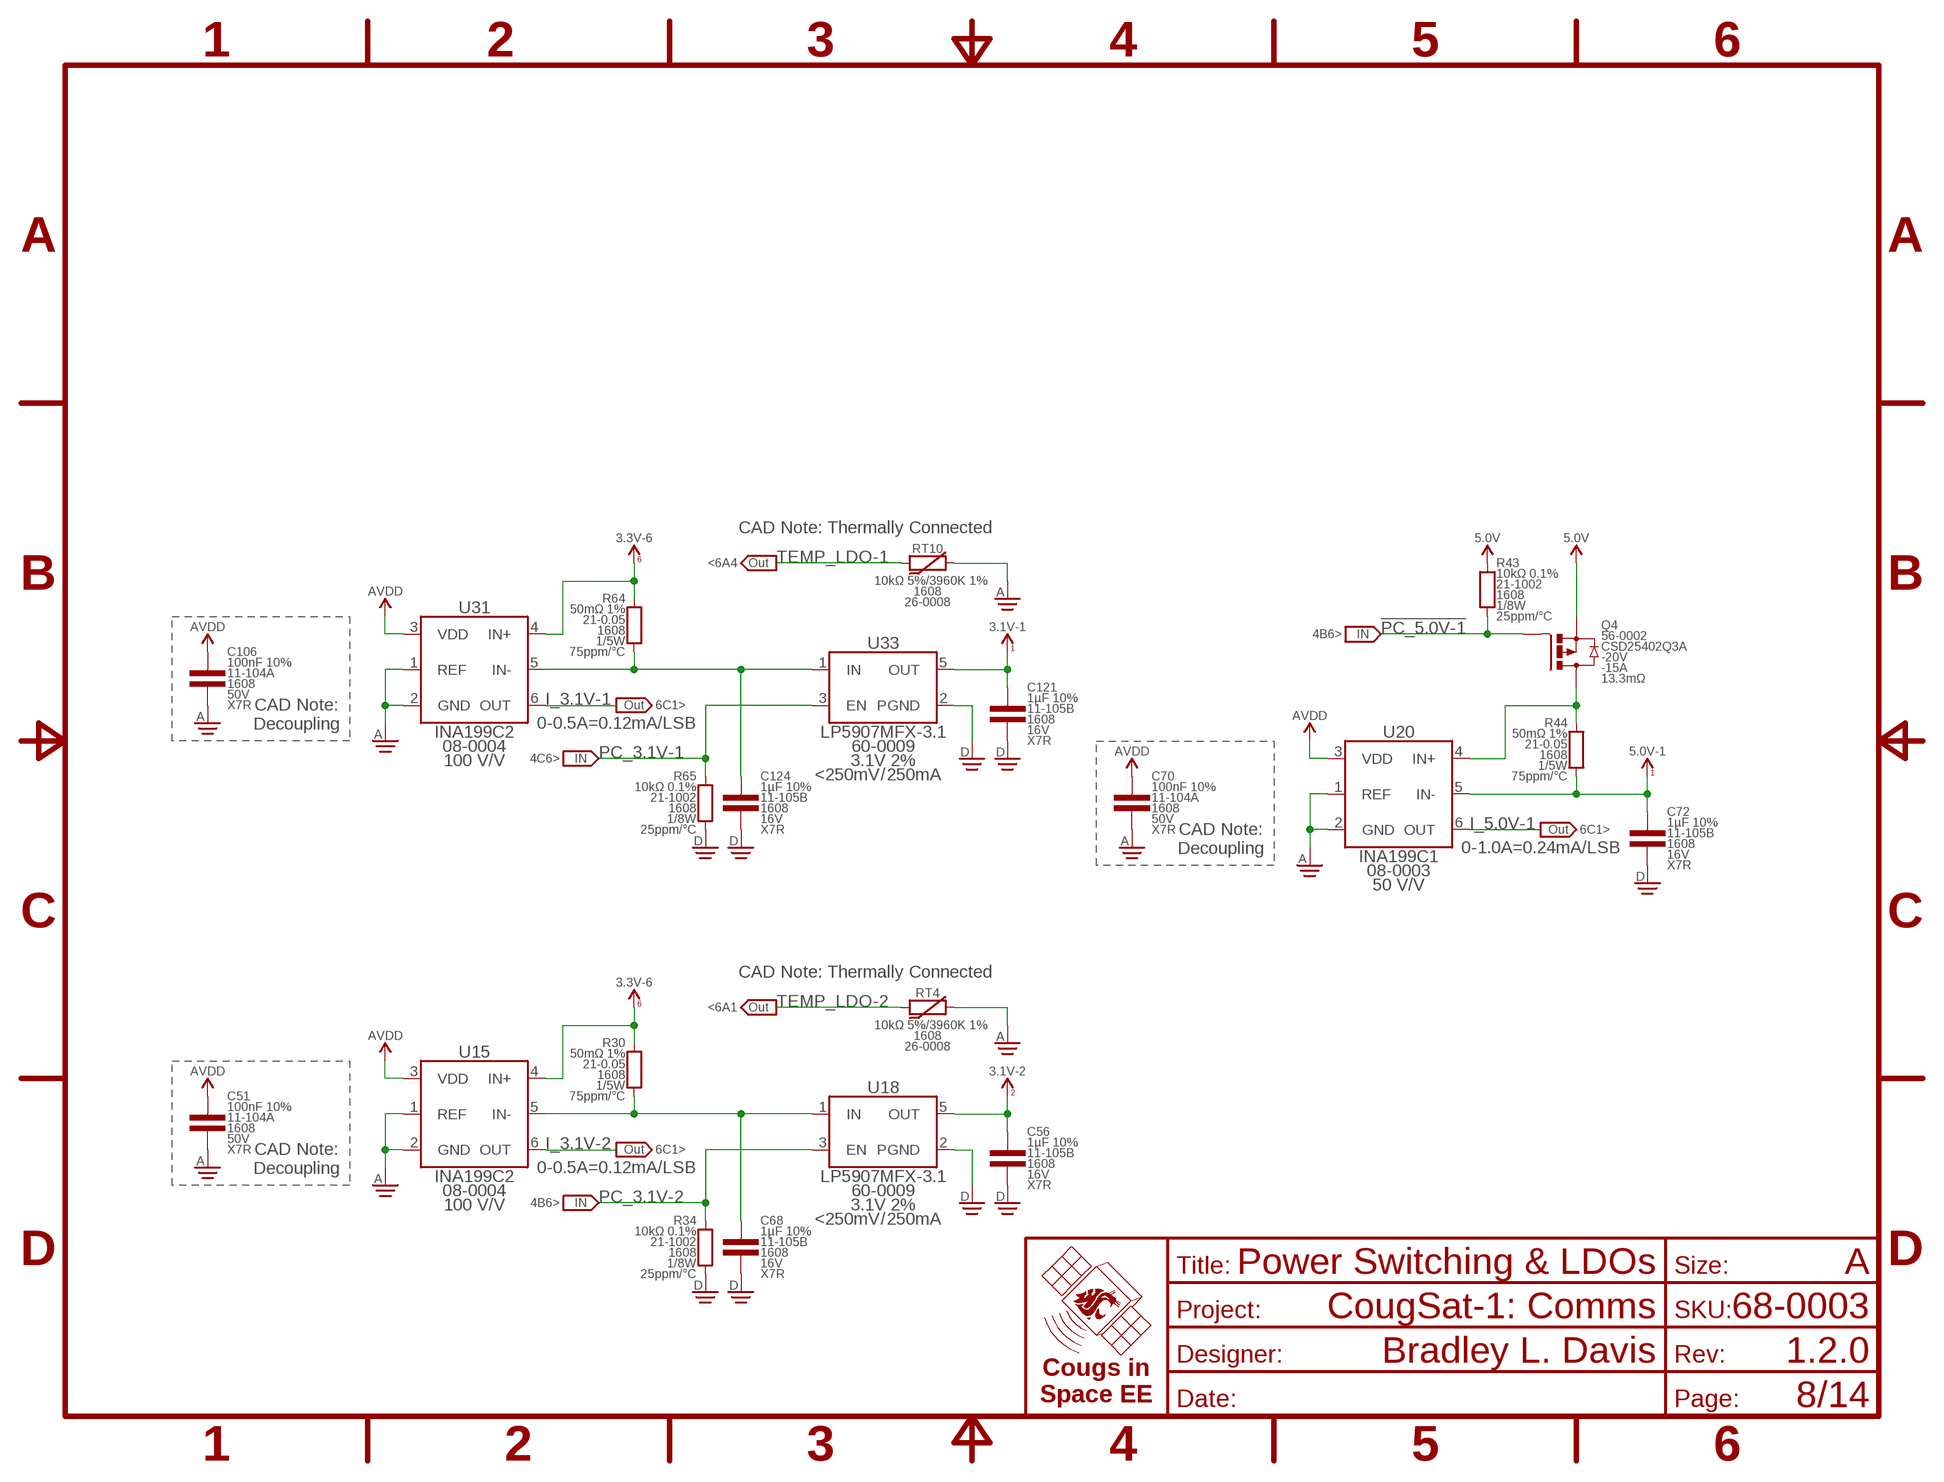
[diagram p7: schematic, sheet 8]
FRAME7 (FRAME-A): TITLE: Power Switching & LDOs

### Parts
C51  100nF 10%  CAP-V-100NF-1608  [1608]
C56  1µF 10%  CAP-V-1UF-B-1608  [1608]
C68  1µF 10%  CAP-V-1UF-B-1608  [1608]
C70  100nF 10%  CAP-V-100NF-1608  [1608]
C72  1µF 10%  CAP-V-1UF-B-1608  [1608]
C106  100nF 10%  CAP-V-100NF-1608  [1608]
C121  1µF 10%  CAP-V-1UF-B-1608  [1608]
C124  1µF 10%  CAP-V-1UF-B-1608  [1608]
Q4  CSD25402Q3A  MOSFET-P-SON-3333  [SON-3333]
R30  50mΩ 1%  RES-V-0.05R-1608  [1608]
R34  10kΩ 0.1%  RES-V-10K-1608  [1608]
R43  10kΩ 0.1%  RES-V-10K-1608  [1608]
R44  50mΩ 1%  RES-V-0.05R-1608  [1608]
R64  50mΩ 1%  RES-V-0.05R-1608  [1608]
R65  10kΩ 0.1%  RES-V-10K-1608  [1608]
RT4  10kΩ 5%  THERMISTOR-H-10K-1608  [1608]
RT10  10kΩ 5%  THERMISTOR-H-10K-1608  [1608]
U15  INA199C2  [SOT363]
U18  LP5907MFX-3.1  LDO-3.1-SOT23-5  [SOT23-5]
U20  INA199C1  [SOT363]
U31  INA199C2  [SOT363]
U33  LP5907MFX-3.1  LDO-3.1-SOT23-5  [SOT23-5]

### Nets
3.1V_1 [Supplies]: C121.1 U33.5(OUT) ; supply symbol labelled 3.1V-1 ; also sheet 9,11
3.1V_2 [Supplies]: C56.1 U18.5(OUT) ; supply symbol labelled 3.1V-2 ; also sheet 10,12,13
3.3V_6 [Supplies]: R30.2 R64.2 U15.4(IN+) U31.4(IN+) ; supply symbol labelled 3.3V-6 ; also sheet 4,5,6,9,10
5.0V [Supplies]: Q4.5(S) Q4.6(S) Q4.7(S) Q4.8(S) Q4.PAD(S) R43.2 ; also sheet 7,11
5.0V_1 [Supplies]: C72.1 R44.1 U20.5(IN-) ; supply symbol labelled 5.0V-1 ; also sheet 11
!PC_5.0V-1: Q4.4(G) R43.1 ; also sheet 4
AGND [AGND]: C51.2 C70.2 C106.2 RT4.2 RT10.2 U15.1(REF) U15.2(GND) U20.1(REF) U20.2(GND) U31.1(REF) U31.2(GND) ; also sheet 3,4,6,7,9,10,11,12,13
AVDD [AGND]: C51.1 C70.1 C106.1 U15.3(VDD) U20.3(VDD) U31.3(VDD) ; also sheet 4,6,7,10,11
DGND [Supplies]: C56.2 C68.2 C72.2 C121.2 C124.2 R34.1 R65.1 U18.2(PGND) U33.2(PGND) ; also sheet 3,4,5,6,7,9,10,11,12,13,14
I_3.1V-1: U31.6(OUT) ; also sheet 6
I_3.1V-1N: C124.1 R64.1 U31.5(IN-) U33.1(IN)
I_3.1V-2: U15.6(OUT) ; also sheet 6
I_3.1V-2N: C68.1 R30.1 U15.5(IN-) U18.1(IN)
I_5.0V-1: U20.6(OUT) ; also sheet 6
I_5.0V_1P: Q4.1(D) Q4.2(D) Q4.3(D) R44.2 U20.4(IN+)
PC_3.1V-1: R65.2 U33.3(EN) ; also sheet 4
PC_3.1V-2: R34.2 U18.3(EN) ; also sheet 4
TEMP_LDO-1: RT10.1 ; also sheet 6
TEMP_LDO-2: RT4.1 ; also sheet 6

### Notes on the sheet
- CAD Note: Thermally Connected
- <6A4
- 4B6>
- 6C1>
- CAD Note:
  Decoupling
- 0-0.5A=0.12mA/LSB
- 4C6>
- 6C1>
- CAD Note:
  Decoupling
- 0-1.0A=0.24mA/LSB
- CAD Note: Thermally Connected
- <6A1
- 6C1>
- CAD Note:
  Decoupling
- 0-0.5A=0.12mA/LSB
- 4B6>

## Sheet 9 of 14
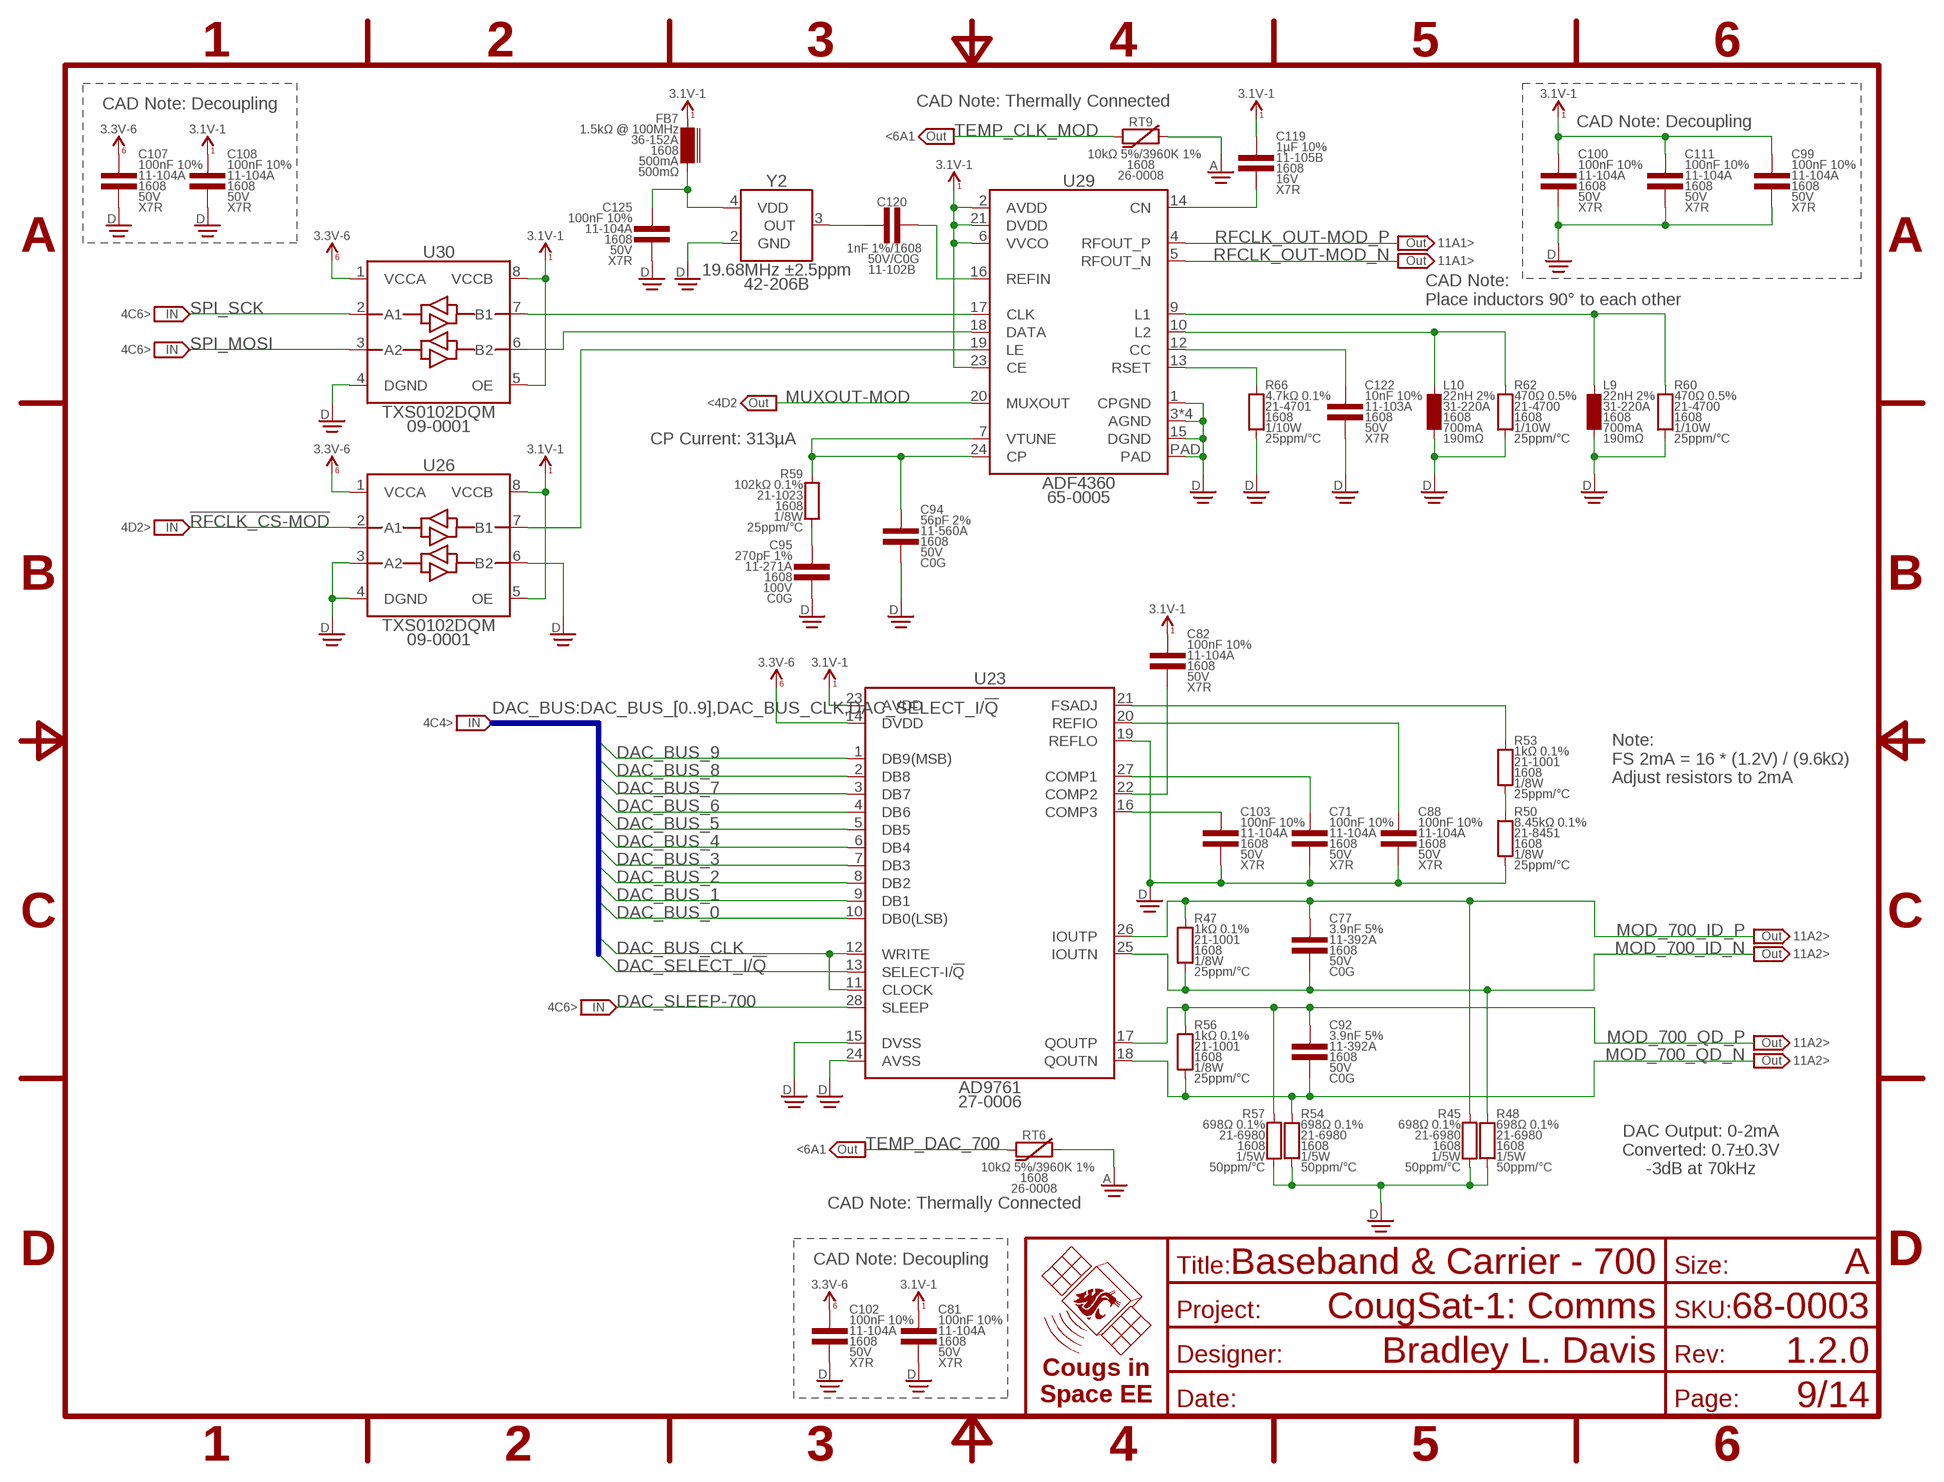
[diagram p8: schematic, sheet 9]
FRAME8 (FRAME-A): TITLE: Baseband & Carrier - 700

### Parts
C71  100nF 10%  CAP-V-100NF-1608  [1608]
C77  3.9nF 5%  CAP-V-3.9NF-1608  [1608]
C81  100nF 10%  CAP-V-100NF-1608  [1608]
C82  100nF 10%  CAP-V-100NF-1608  [1608]
C88  100nF 10%  CAP-V-100NF-1608  [1608]
C92  3.9nF 5%  CAP-V-3.9NF-1608  [1608]
C94  56pF 2%  CAP-V-56PF-1608  [1608]
C95  270pF 1%  CAP-V-270PF-1608  [1608]
C99  100nF 10%  CAP-V-100NF-1608  [1608]
C100  100nF 10%  CAP-V-100NF-1608  [1608]
C102  100nF 10%  CAP-V-100NF-1608  [1608]
C103  100nF 10%  CAP-V-100NF-1608  [1608]
C107  100nF 10%  CAP-V-100NF-1608  [1608]
C108  100nF 10%  CAP-V-100NF-1608  [1608]
C111  100nF 10%  CAP-V-100NF-1608  [1608]
C119  1µF 10%  CAP-V-1UF-B-1608  [1608]
C120  1nF 1%  CAP-H-1NF-B-1608  [1608]
C122  10nF 10%  CAP-V-10NF-1608  [1608]
C125  100nF 10%  CAP-V-100NF-1608  [1608]
FB7  1.5kΩ @ 100MHz  CHOKE-V-1.5K-1608  [1608]
L9  22nH 2%  INDUCTOR-V-22NH-1608  [1608]
L10  22nH 2%  INDUCTOR-V-22NH-1608  [1608]
R45  698Ω 0.1%  RES-V-698R-1608  [1608]
R47  1kΩ 0.1%  RES-V-1K-1608  [1608]
R48  698Ω 0.1%  RES-V-698R-1608  [1608]
R50  8.45kΩ 0.1%  RES-V-8.45K-1608  [1608]
R53  1kΩ 0.1%  RES-V-1K-1608  [1608]
R54  698Ω 0.1%  RES-V-698R-1608  [1608]
R56  1kΩ 0.1%  RES-V-1K-1608  [1608]
R57  698Ω 0.1%  RES-V-698R-1608  [1608]
R59  102kΩ 0.1%  RES-V-102K-1608  [1608]
R60  470Ω 0.5%  RES-V-470R-1608  [1608]
R62  470Ω 0.5%  RES-V-470R-1608  [1608]
R66  4.7kΩ 0.1%  RES-V-4.7K-1608  [1608]
RT6  10kΩ 5%  THERMISTOR-H-10K-1608  [1608]
RT9  10kΩ 5%  THERMISTOR-H-10K-1608  [1608]
U23  AD9761  [SSOP-28]
U26  TXS0102DQM  LEVEL_SHIFTER-2BIT-XSON-8  [X2SON-8]
U29  ADF4360  [QFN-24-4040]
U30  TXS0102DQM  LEVEL_SHIFTER-2BIT-XSON-8  [X2SON-8]
Y2  19.68MHz ±2.5ppm  OSCILLATOR-19.68M-SMD-3225  [SMD-3225]

### Nets
3.1V_1 [Supplies]: C81.1 C82.1 C99.1 C100.1 C108.1 C111.1 C119.1 FB7.2 U23.23(AVDD) U26.5(OE) U26.8(VCCB) U29.2(AVDD) U29.6(VVCO) U29.21(DVDD) U29.23(CE) U30.5(OE) U30.8(VCCB) ; supply symbol labelled 3.1V-1 ; also sheet 8,11
3.3V_6 [Supplies]: C102.1 C107.1 U23.14(DVDD) U26.1(VCCA) U30.1(VCCA) ; supply symbol labelled 3.3V-6 ; also sheet 4,5,6,8,10
!MOD_CS: U26.7(B1) U29.19(LE)
!RFCLK_CS-MOD: U26.2(A1) ; also sheet 4
AGND [AGND]: RT6.2 RT9.2 ; also sheet 3,4,6,7,8,10,11,12,13
DAC_BUS_0: U23.10(DB0(LSB)) ; also sheet 4
DAC_BUS_1: U23.9(DB1) ; also sheet 4
DAC_BUS_2: U23.8(DB2) ; also sheet 4
DAC_BUS_3: U23.7(DB3) ; also sheet 4
DAC_BUS_4: U23.6(DB4) ; also sheet 4
DAC_BUS_5: U23.5(DB5) ; also sheet 4
DAC_BUS_6: U23.4(DB6) ; also sheet 4
DAC_BUS_7: U23.3(DB7) ; also sheet 4
DAC_BUS_8: U23.2(DB8) ; also sheet 4
DAC_BUS_9: U23.1(DB9(MSB)) ; also sheet 4
DAC_BUS_CLK: U23.11(CLOCK) U23.12(WRITE) ; also sheet 4
DAC_COMP1-700: C71.1 U23.27(COMP1)
DAC_COMP2-700: C82.2 U23.22(COMP2)
DAC_COMP3-700: C103.1 U23.16(COMP3)
DAC_FSADJ-700: R53.2 U23.21(FSADJ)
DAC_FSASJ_MID-700: R50.2 R53.1
DAC_REFIO-700: C88.1 U23.20(REFIO)
DAC_SELECT_I/!Q: U23.13(SELECT-I/!Q) ; also sheet 4
DAC_SLEEP-700: U23.28(SLEEP) ; also sheet 4
DGND [Supplies]: C71.2 C81.2 C88.2 C94.2 C95.2 C99.2 C100.2 C102.2 C103.2 C107.2 C108.2 C111.2 C122.2 C125.2 L9.1 L10.1 R45.1 R48.1 R50.1 R54.1 R57.1 R60.1 R62.1 R66.1 U23.15(DVSS) U23.19(REFLO) U23.24(AVSS) U26.3(A2) U26.4(DGND) U26.6(B2) U29.1(CPGND) U29.3(AGND) U29.8(AGND) U29.11(AGND) U29.15(DGND) U29.22(AGND) U29.PAD U30.4(DGND) Y2.2(GND) ; also sheet 3,4,5,6,7,8,10,11,12,13,14
MOD_700_ID_N: C77.2 R47.1 R48.2 U23.25(IOUTN) ; also sheet 11
MOD_700_ID_P: C77.1 R45.2 R47.2 U23.26(IOUTP) ; also sheet 11
MOD_700_QD_N: C92.2 R54.2 R56.1 U23.18(QOUTN) ; also sheet 11
MOD_700_QD_P: C92.1 R56.2 R57.2 U23.17(QOUTP) ; also sheet 11
MOD_MOSI: U29.18(DATA) U30.6(B2)
MOD_SCK: U29.17(CLK) U30.7(B1)
MUXOUT-MOD: U29.20(MUXOUT) ; also sheet 4
REF_CLK_VDD-1 [Supplies]: C125.1 FB7.1 Y2.4(VDD)
RFCLK_CC-MOD: C122.1 U29.12(CC)
RFCLK_CN-MOD: C119.2 U29.14(CN)
RFCLK_CP-MOD: C94.1 R59.2 U29.7(VTUNE) U29.24(CP)
RFCLK_L1-MOD: L9.2 R60.2 U29.9(L1)
RFCLK_L2-MOD: L10.2 R62.2 U29.10(L2)
RFCLK_OUT-MOD_N [50Ohm]: U29.5(RFOUT_N) ; also sheet 11
RFCLK_OUT-MOD_P [50Ohm]: U29.4(RFOUT_P) ; also sheet 11
RFCLK_REFIN-MOD: C120.2 U29.16(REFIN)
RFCLK_REFOUT-MOD: C120.1 Y2.3(OUT)
RFCLK_RSET-MOD: R66.2 U29.13(RSET)
RFCLK_VTUNE_FILTER-MOD: C95.1 R59.1
SPI_MOSI: U30.3(A2) ; also sheet 4,10
SPI_SCK: U30.2(A1) ; also sheet 4,10
TEMP_CLK_MOD: RT9.1 ; also sheet 6
TEMP_DAC_700: RT6.1 ; also sheet 6

### Buses
DAC_BUS:DAC_BUS_[0..9],DAC_BUS_CLK,DAC_SELECT_I/!Q

### Notes on the sheet
- CAD Note: Thermally Connected
- CAD Note: Decoupling
- CAD Note: Decoupling
- <6A1
- 11A1>
- 11A1>
- CAD Note:
  Place inductors 90° to each other
- 4C6>
- 4C6>
- <4D2
- CP Current: 313µA
- 4D2>
- 4C4>
- Note:
  FS 2mA = 16 * (1.2V) / (9.6kΩ)
  Adjust resistors to 2mA
- 11A2>
- 11A2>
- 4C6>
- 11A2>
- 11A2>
- <6A1
- DAC Output: 0-2mA
  Converted: 0.7±0.3V
  -3dB at 70kHz
- CAD Note: Thermally Connected
- CAD Note: Decoupling

## Sheet 10 of 14
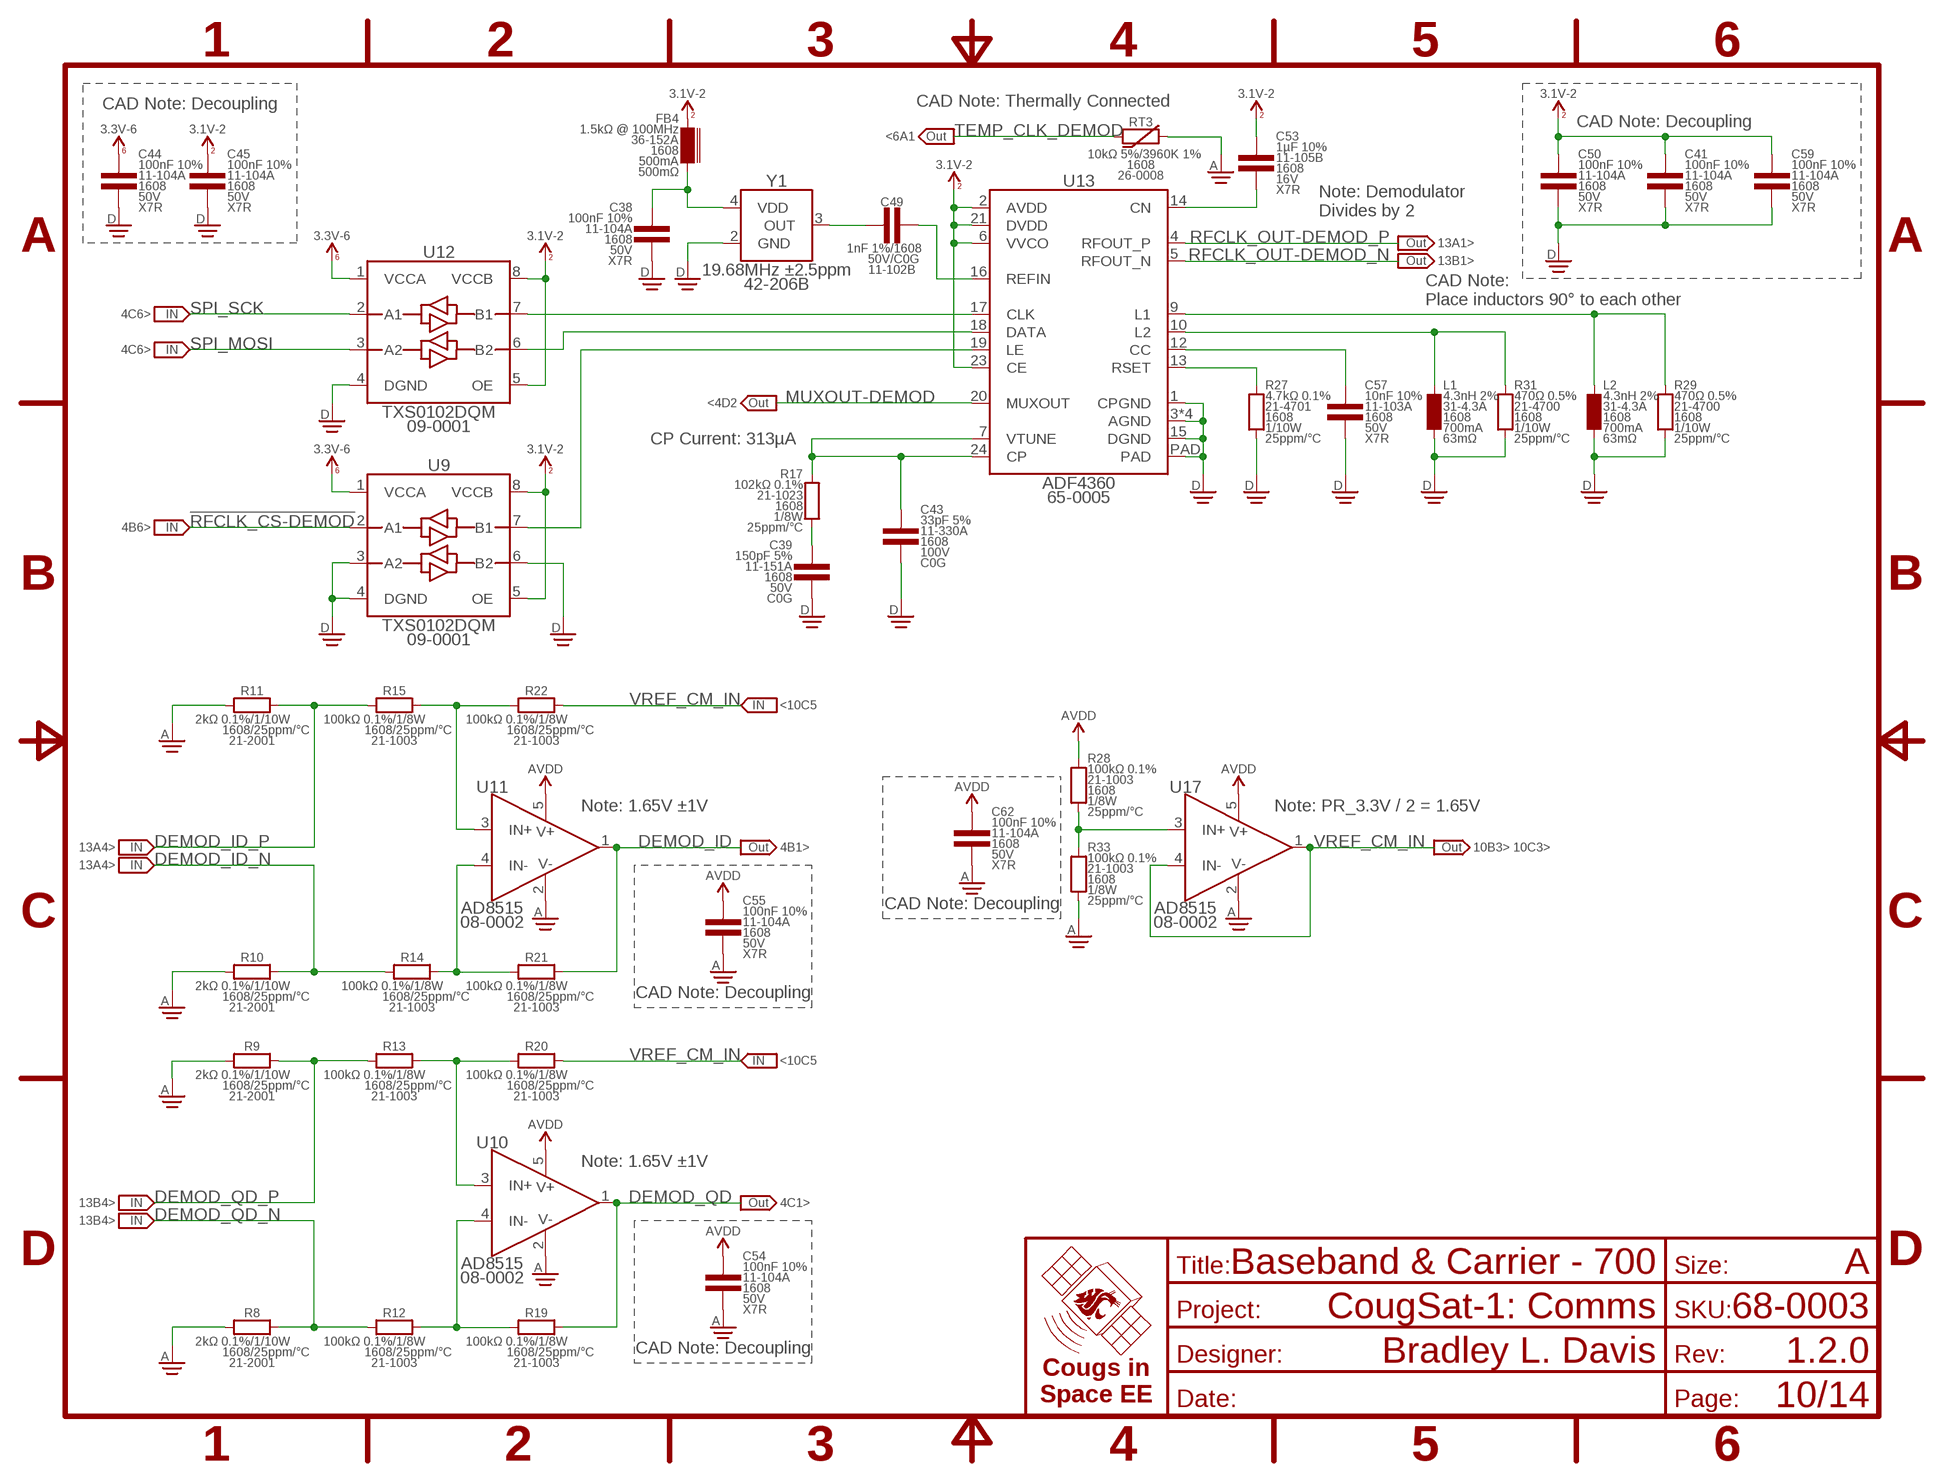
[diagram p9: schematic, sheet 10]
FRAME13 (FRAME-A): TITLE: Baseband & Carrier - 700

### Parts
C38  100nF 10%  CAP-V-100NF-1608  [1608]
C39  150pF 5%  CAP-V-150PF-1608  [1608]
C41  100nF 10%  CAP-V-100NF-1608  [1608]
C43  33pF 5%  CAP-V-33PF-1608  [1608]
C44  100nF 10%  CAP-V-100NF-1608  [1608]
C45  100nF 10%  CAP-V-100NF-1608  [1608]
C49  1nF 1%  CAP-H-1NF-B-1608  [1608]
C50  100nF 10%  CAP-V-100NF-1608  [1608]
C53  1µF 10%  CAP-V-1UF-B-1608  [1608]
C54  100nF 10%  CAP-V-100NF-1608  [1608]
C55  100nF 10%  CAP-V-100NF-1608  [1608]
C57  10nF 10%  CAP-V-10NF-1608  [1608]
C59  100nF 10%  CAP-V-100NF-1608  [1608]
C62  100nF 10%  CAP-V-100NF-1608  [1608]
FB4  1.5kΩ @ 100MHz  CHOKE-V-1.5K-1608  [1608]
L1  4.3nH 2%  INDUCTOR-V-4.3NH-1608  [1608]
L2  4.3nH 2%  INDUCTOR-V-4.3NH-1608  [1608]
R8  2kΩ 0.1%  RES-H-2K-1608  [1608]
R9  2kΩ 0.1%  RES-H-2K-1608  [1608]
R10  2kΩ 0.1%  RES-H-2K-1608  [1608]
R11  2kΩ 0.1%  RES-H-2K-1608  [1608]
R12  100kΩ 0.1%  RES-H-100K-1608  [1608]
R13  100kΩ 0.1%  RES-H-100K-1608  [1608]
R14  100kΩ 0.1%  RES-H-100K-1608  [1608]
R15  100kΩ 0.1%  RES-H-100K-1608  [1608]
R17  102kΩ 0.1%  RES-V-102K-1608  [1608]
R19  100kΩ 0.1%  RES-H-100K-1608  [1608]
R20  100kΩ 0.1%  RES-H-100K-1608  [1608]
R21  100kΩ 0.1%  RES-H-100K-1608  [1608]
R22  100kΩ 0.1%  RES-H-100K-1608  [1608]
R27  4.7kΩ 0.1%  RES-V-4.7K-1608  [1608]
R28  100kΩ 0.1%  RES-V-100K-1608  [1608]
R29  470Ω 0.5%  RES-V-470R-1608  [1608]
R31  470Ω 0.5%  RES-V-470R-1608  [1608]
R33  100kΩ 0.1%  RES-V-100K-1608  [1608]
RT3  10kΩ 5%  THERMISTOR-H-10K-1608  [1608]
U9  TXS0102DQM  LEVEL_SHIFTER-2BIT-XSON-8  [X2SON-8]
U10  AD8515  OPAMP-1-AD8515  [SOT23-5]
U11  AD8515  OPAMP-1-AD8515  [SOT23-5]
U12  TXS0102DQM  LEVEL_SHIFTER-2BIT-XSON-8  [X2SON-8]
U13  ADF4360  [QFN-24-4040]
U17  AD8515  OPAMP-1-AD8515  [SOT23-5]
Y1  19.68MHz ±2.5ppm  OSCILLATOR-19.68M-SMD-3225  [SMD-3225]

### Nets
3.1V_2 [Supplies]: C41.1 C45.1 C50.1 C53.1 C59.1 FB4.2 U9.5(OE) U9.8(VCCB) U12.5(OE) U12.8(VCCB) U13.2(AVDD) U13.6(VVCO) U13.21(DVDD) U13.23(CE) ; supply symbol labelled 3.1V-2 ; also sheet 8,12,13
3.3V_6 [Supplies]: C44.1 U9.1(VCCA) U12.1(VCCA) ; supply symbol labelled 3.3V-6 ; also sheet 4,5,6,8,9
!DEMOD_CS: U9.7(B1) U13.19(LE)
!RFCLK_CS-DEMOD: U9.2(A1) ; also sheet 4
AGND [AGND]: C54.2 C55.2 C62.2 R8.1 R9.1 R10.1 R11.1 R33.1 RT3.2 U10.2(V-) U11.2(V-) U17.2(V-) ; also sheet 3,4,6,7,8,9,11,12,13
AVDD [AGND]: C54.1 C55.1 C62.1 R28.2 U10.5(V+) U11.5(V+) U17.5(V+) ; also sheet 4,6,7,8,11
DEMOD_AMP_ID_IN+: R15.2 R22.1 U11.3(IN+)
DEMOD_AMP_ID_IN-: R14.2 R21.1 U11.4(IN-)
DEMOD_AMP_QD_IN+: R13.2 R20.1 U10.3(IN+)
DEMOD_AMP_QD_IN-: R12.2 R19.1 U10.4(IN-)
DEMOD_ID: R21.2 U11.1(OUT) ; also sheet 4
DEMOD_ID_N: R10.2 R14.1 ; also sheet 13
DEMOD_ID_P: R11.2 R15.1 ; also sheet 13
DEMOD_MOSI: U12.6(B2) U13.18(DATA)
DEMOD_QD: R19.2 U10.1(OUT) ; also sheet 4
DEMOD_QD_N: R8.2 R12.1 ; also sheet 13
DEMOD_QD_P: R9.2 R13.1 ; also sheet 13
DEMOD_SCK: U12.7(B1) U13.17(CLK)
DGND [Supplies]: C38.2 C39.2 C41.2 C43.2 C44.2 C45.2 C50.2 C57.2 C59.2 L1.1 L2.1 R27.1 R29.1 R31.1 U9.3(A2) U9.4(DGND) U9.6(B2) U12.4(DGND) U13.1(CPGND) U13.3(AGND) U13.8(AGND) U13.11(AGND) U13.15(DGND) U13.22(AGND) U13.PAD Y1.2(GND) ; also sheet 3,4,5,6,7,8,9,11,12,13,14
MUXOUT-DEMOD: U13.20(MUXOUT) ; also sheet 4
REF_CLK_VDD-2 [Supplies]: C38.1 FB4.1 Y1.4(VDD)
RFCLK_CC-DEMOD: C57.1 U13.12(CC)
RFCLK_CN-DEMOD: C53.2 U13.14(CN)
RFCLK_CP-DEMOD: C43.1 R17.2 U13.7(VTUNE) U13.24(CP)
RFCLK_L1-DEMOD: L2.2 R29.2 U13.9(L1)
RFCLK_L2-DEMOD: L1.2 R31.2 U13.10(L2)
RFCLK_OUT-DEMOD_N [50Ohm]: U13.5(RFOUT_N) ; also sheet 13
RFCLK_OUT-DEMOD_P [50Ohm]: U13.4(RFOUT_P) ; also sheet 13
RFCLK_REFIN-DEMOD: C49.2 U13.16(REFIN)
RFCLK_REFOUT-DEMOD: C49.1 Y1.3(OUT)
RFCLK_RSET-DEMOD: R27.2 U13.13(RSET)
RFCLK_VTUNE_FILTER-DEMOD: C39.1 R17.1
SPI_MOSI: U12.3(A2) ; also sheet 4,9
SPI_SCK: U12.2(A1) ; also sheet 4,9
TEMP_CLK_DEMOD: RT3.1 ; also sheet 6
VREF_CM_IN: R20.2 R22.2 U17.1(OUT) U17.4(IN-)
VREF_CM_IN_AMP_IN: R28.1 R33.2 U17.3(IN+)

### Notes on the sheet
- CAD Note: Thermally Connected
- CAD Note: Decoupling
- CAD Note: Decoupling
- <6A1
- Note: Demodulator
  Divides by 2
- 13A1>
- 13B1>
- CAD Note:
  Place inductors 90° to each other
- 4C6>
- 4C6>
- <4D2
- CP Current: 313µA
- 4B6>
- <10C5
- Note: 1.65V ±1V | Note: PR_3.3V / 2 = 1.65V
- 13A4> | 4B1> | 10B3> 10C3>
- 13A4>
- CAD Note: Decoupling
- CAD Note: Decoupling
- <10C5
- Note: 1.65V ±1V
- 13B4> | 4C1>
- 13B4>
- CAD Note: Decoupling

## Sheet 11 of 14
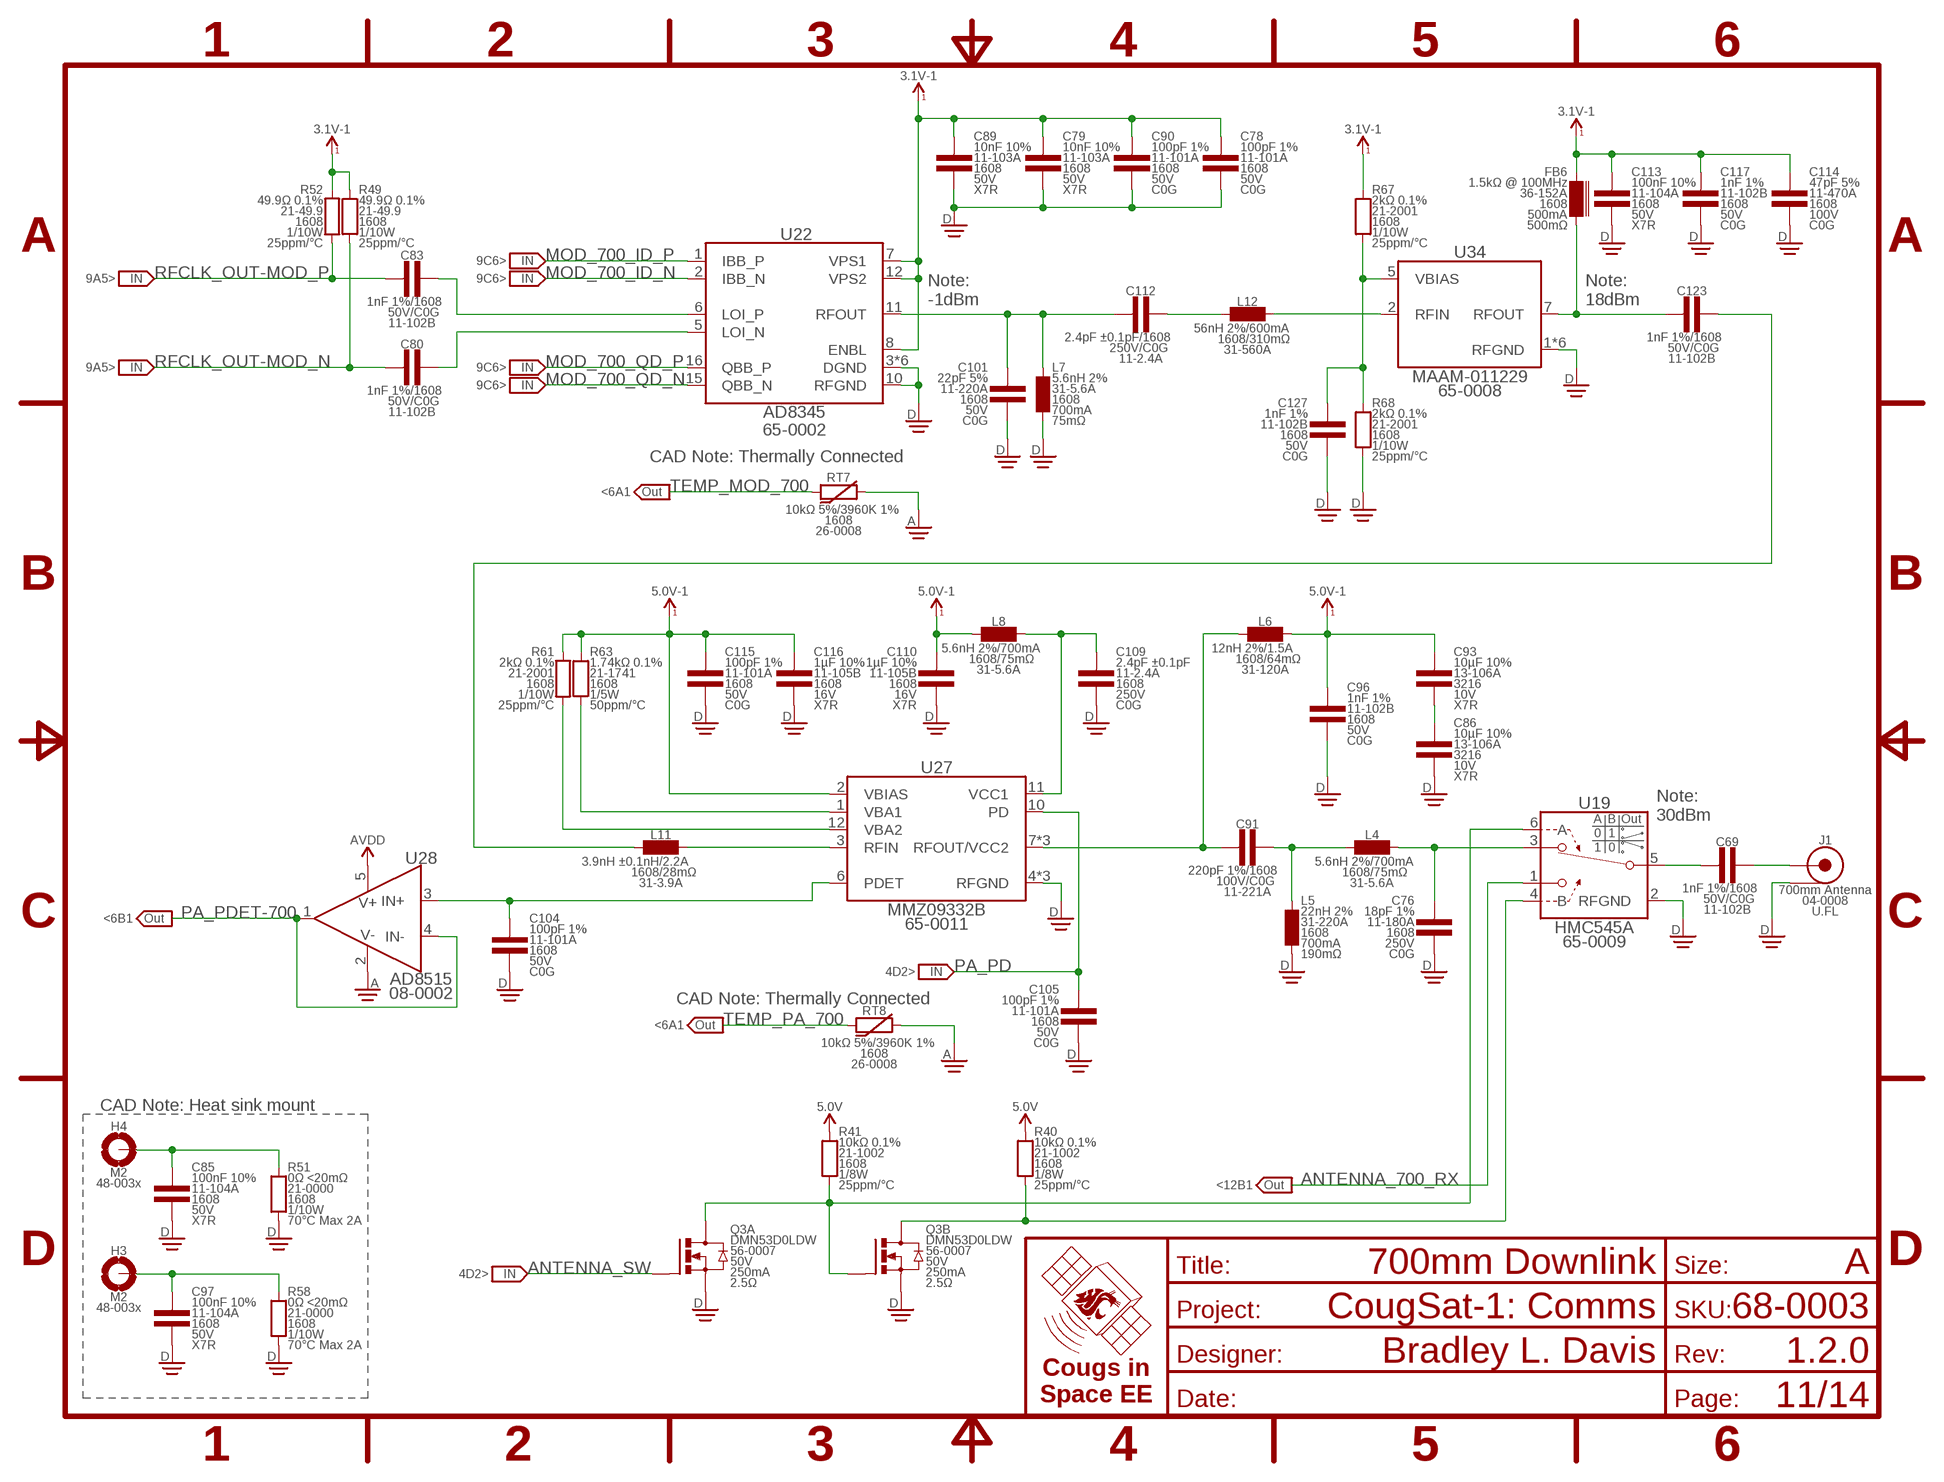
[diagram p10: schematic, sheet 11]
FRAME14 (FRAME-A): TITLE: 700mm Downlink

### Parts
C69  1nF 1%  CAP-H-1NF-B-1608  [1608]
C76  18pF 1%  CAP-V-18PF-1608  [1608]
C78  100pF 1%  CAP-V-100PF-1608  [1608]
C79  10nF 10%  CAP-V-10NF-1608  [1608]
C80  1nF 1%  CAP-H-1NF-B-1608  [1608]
C83  1nF 1%  CAP-H-1NF-B-1608  [1608]
C85  100nF 10%  CAP-V-100NF-1608  [1608]
C86  10µF 10%  CAP-V-10UF-3216  [3216]
C89  10nF 10%  CAP-V-10NF-1608  [1608]
C90  100pF 1%  CAP-V-100PF-1608  [1608]
C91  220pF 1%  CAP-H-220PF-1608  [1608]
C93  10µF 10%  CAP-V-10UF-3216  [3216]
C96  1nF 1%  CAP-V-1NF-B-1608  [1608]
C97  100nF 10%  CAP-V-100NF-1608  [1608]
C101  22pF 5%  CAP-V-22PF-1608  [1608]
C104  100pF 1%  CAP-V-100PF-1608  [1608]
C105  100pF 1%  CAP-V-100PF-1608  [1608]
C109  2.4pF ±0.1pF  CAP-V-2.4PF-1608  [1608]
C110  1µF 10%  CAP-V-1UF-B-1608  [1608]
C112  2.4pF ±0.1pF  CAP-H-2.4PF-1608  [1608]
C113  100nF 10%  CAP-V-100NF-1608  [1608]
C114  47pF 5%  CAP-V-47PF-1608  [1608]
C115  100pF 1%  CAP-V-100PF-1608  [1608]
C116  1µF 10%  CAP-V-1UF-B-1608  [1608]
C117  1nF 1%  CAP-V-1NF-B-1608  [1608]
C123  1nF 1%  CAP-H-1NF-B-1608  [1608]
C127  1nF 1%  CAP-V-1NF-B-1608  [1608]
FB6  1.5kΩ @ 100MHz  CHOKE-V-1.5K-1608  [1608]
H3  M2  MOUNTING_HOLE-2.2  [MOUNTING_HOLE-2.2]
H4  M2  MOUNTING_HOLE-2.2  [MOUNTING_HOLE-2.2]
J1  700mm Antenna  COAX-U.FL  [U.FL]
L4  5.6nH 2%  INDUCTOR-H-5.6NH-1608  [1608]
L5  22nH 2%  INDUCTOR-V-22NH-1608  [1608]
L6  12nH 2%  INDUCTOR-H-12NH-1608  [1608]
L7  5.6nH 2%  INDUCTOR-V-5.6NH-1608  [1608]
L8  5.6nH 2%  INDUCTOR-H-5.6NH-1608  [1608]
L11  3.9nH ±0.1nH  INDUCTOR-H-3.9NH-1608  [1608]
L12  56nH 2%  INDUCTOR-H-56NH-1608  [1608]
Q3  DMN53D0LDW  MOSFET_DUAL-N-DMN53D0LDW-SOT363  [SOT363]
R40  10kΩ 0.1%  RES-V-10K-1608  [1608]
R41  10kΩ 0.1%  RES-V-10K-1608  [1608]
R49  49.9Ω 0.1%  RES-V-49.9-1608  [1608]
R51  0Ω <20mΩ  RES-V-0-1608  [1608]
R52  49.9Ω 0.1%  RES-V-49.9-1608  [1608]
R58  0Ω <20mΩ  RES-V-0-1608  [1608]
R61  2kΩ 0.1%  RES-V-2K-1608  [1608]
R63  1.74kΩ 0.1%  RES-V-1.74K-1608  [1608]
R67  2kΩ 0.1%  RES-V-2K-1608  [1608]  (not fitted in variant Main)
R68  2kΩ 0.1%  RES-V-2K-1608  [1608]  (not fitted in variant Main)
RT7  10kΩ 5%  THERMISTOR-H-10K-1608  [1608]
RT8  10kΩ 5%  THERMISTOR-H-10K-1608  [1608]
U19  HMC545A  SW-SPDT-SOT23-6  [SOT23-6]
U22  AD8345  AD834X5  [TSSOP-16]
U27  MMZ09332B  [QFN-12-3030]
U28  AD8515  OPAMP-1-AD8515  [SOT23-5]
U34  MAAM-011229  AMP-BIAS-MAAM-011229  [DFN-8-2020]

### Nets
3.1V_1 [Supplies]: C78.1 C79.1 C89.1 C90.1 C113.1 C114.1 C117.1 FB6.2 R49.2 R52.2 R67.2 U22.7(VPS1) U22.8(ENBL) U22.12(VPS2) ; supply symbol labelled 3.1V-1 ; also sheet 8,9
5.0V [Supplies]: R40.2 R41.2 ; also sheet 7,8
5.0V_1 [Supplies]: C93.1 C96.1 C110.1 C115.1 C116.1 L6.2 L8.1 R61.2 R63.2 U27.2(VBIAS) ; supply symbol labelled 5.0V-1 ; also sheet 8
AGND [AGND]: RT7.2 RT8.2 U28.2(V-) ; also sheet 3,4,6,7,8,9,10,12,13
ANTENNA_700 [50Ohm]: C69.1 U19.5(RFC)
ANTENNA_700_COAX [50Ohm]: C69.2 J1.CENTER
ANTENNA_700_RX [50Ohm]: U19.1(RF2) ; also sheet 12
ANTENNA_700_TX [50Ohm]: C76.1 L4.2 U19.3(RF1)
ANTENNA_SW: Q3.2(A:G) ; also sheet 4
ANTENNA_SW_A: Q3.5(B:G) Q3.6(A:D) R41.1 U19.6(A)
ANTENNA_SW_B: Q3.3(B:D) R40.1 U19.4(B)
AVDD [AGND]: U28.5(V+) ; also sheet 4,6,7,8,10
CHASSIS_700-0 [Supplies]: C85.1 H4.1(MOUNT) H4.V1(MOUNT) H4.V2(MOUNT) H4.V3(MOUNT) H4.V4(MOUNT) H4.V5(MOUNT) H4.V6(MOUNT) H4.V7(MOUNT) H4.V8(MOUNT) R51.2
CHASSIS_700-1 [Supplies]: C97.1 H3.1(MOUNT) H3.V1(MOUNT) H3.V2(MOUNT) H3.V3(MOUNT) H3.V4(MOUNT) H3.V5(MOUNT) H3.V6(MOUNT) H3.V7(MOUNT) H3.V8(MOUNT) R58.2
DGND [Supplies]: C76.2 C78.2 C79.2 C85.2 C86.2 C89.2 C90.2 C96.2 C97.2 C101.2 C104.2 C105.2 C109.2 C110.2 C113.2 C114.2 C115.2 C116.2 C117.2 C127.2 J1.SHIELD@1(SHIELD) J1.SHIELD@2(SHIELD) J1.SHIELD@13(SHIELD) L5.1 L7.1 Q3.1(A:S) Q3.4(B:S) R51.1 R58.1 R68.1 U19.2(RFGND) U22.3(DGND) U22.4(DGND) U22.9(DGND) U22.10(RFGND) U22.13(DGND) U22.14(DGND) U22.PAD(DGND) U27.4(RFGND) U27.5(RFGND) U27.PAD(RFGND) U34.1(RFGND) U34.3(RFGND) U34.4(RFGND) U34.6(RFGND) U34.8(RFGND) U34.PAD(RFGND) ; also sheet 3,4,5,6,7,8,9,10,12,13,14
MOD_700_ID_N: U22.2(IBB_N) ; also sheet 9
MOD_700_ID_P: U22.1(IBB_P) ; also sheet 9
MOD_700_LOI_N [50Ohm]: C80.2 U22.5(LOI_N)
MOD_700_LOI_P [50Ohm]: C83.2 U22.6(LOI_P)
MOD_700_QD_N: U22.15(QBB_N) ; also sheet 9
MOD_700_QD_P: U22.16(QBB_P) ; also sheet 9
MOD_700_RFOUT [50Ohm]: C101.1 C112.1 L7.2 U22.11(RFOUT)
MOD_LNA_700_RFIN [50Ohm]: L12.2 U34.2(RFIN)
MOD_LNA_700_RFINMID [50Ohm]: C112.2 L12.1
MOD_LNA_700_RFOUT [50Ohm]: C123.1 FB6.1 U34.7(RFOUT)
MOD_PA_700_RFIN [50Ohm]: L11.2 U27.3(RFIN)
MOD_PA_700_RFINMID [50Ohm]: C123.2 L11.1
PA_CAPMID: C86.1 C93.2
PA_PD: C105.1 U27.10(PD) ; also sheet 4
PA_PDET-700: U28.1(OUT) U28.4(IN-) ; also sheet 6
PA_PDET_UNBUF-700: C104.1 U27.6(PDET) U28.3(IN+)
PA_RFOUT-700 [50Ohm]: C91.1 L6.1 U27.7(RFOUT/VCC2) U27.8(RFOUT/VCC2) U27.9(RFOUT/VCC2)
PA_RFOUTMID-700 [50Ohm]: C91.2 L4.1 L5.2
PA_VBA1-700: R63.1 U27.1(VBA1)
PA_VBA2-700: R61.1 U27.12(VBA2)
PA_VCC1-700: C109.1 L8.2 U27.11(VCC1)
PREAMP_700_BIAS: C127.1 R67.1 R68.2 U34.5(VBIAS)
RFCLK_OUT-MOD_N [50Ohm]: C80.1 R49.1 ; also sheet 9
RFCLK_OUT-MOD_P [50Ohm]: C83.1 R52.1 ; also sheet 9
TEMP_MOD_700: RT7.1 ; also sheet 6
TEMP_PA_700: RT8.1 ; also sheet 6

### Notes on the sheet
- 9C6>
- 9A5> | 9C6>
- Note:
  -1dBm
- Note:
  18dBm
- 9A5> | 9C6>
- 9C6>
- CAD Note: Thermally Connected
- <6A1
- Note:
  30dBm
- <6B1
- 4D2>
- CAD Note: Thermally Connected
- <6A1
- CAD Note: Heat sink mount
- <12B1
- 4D2>

## Sheet 12 of 14
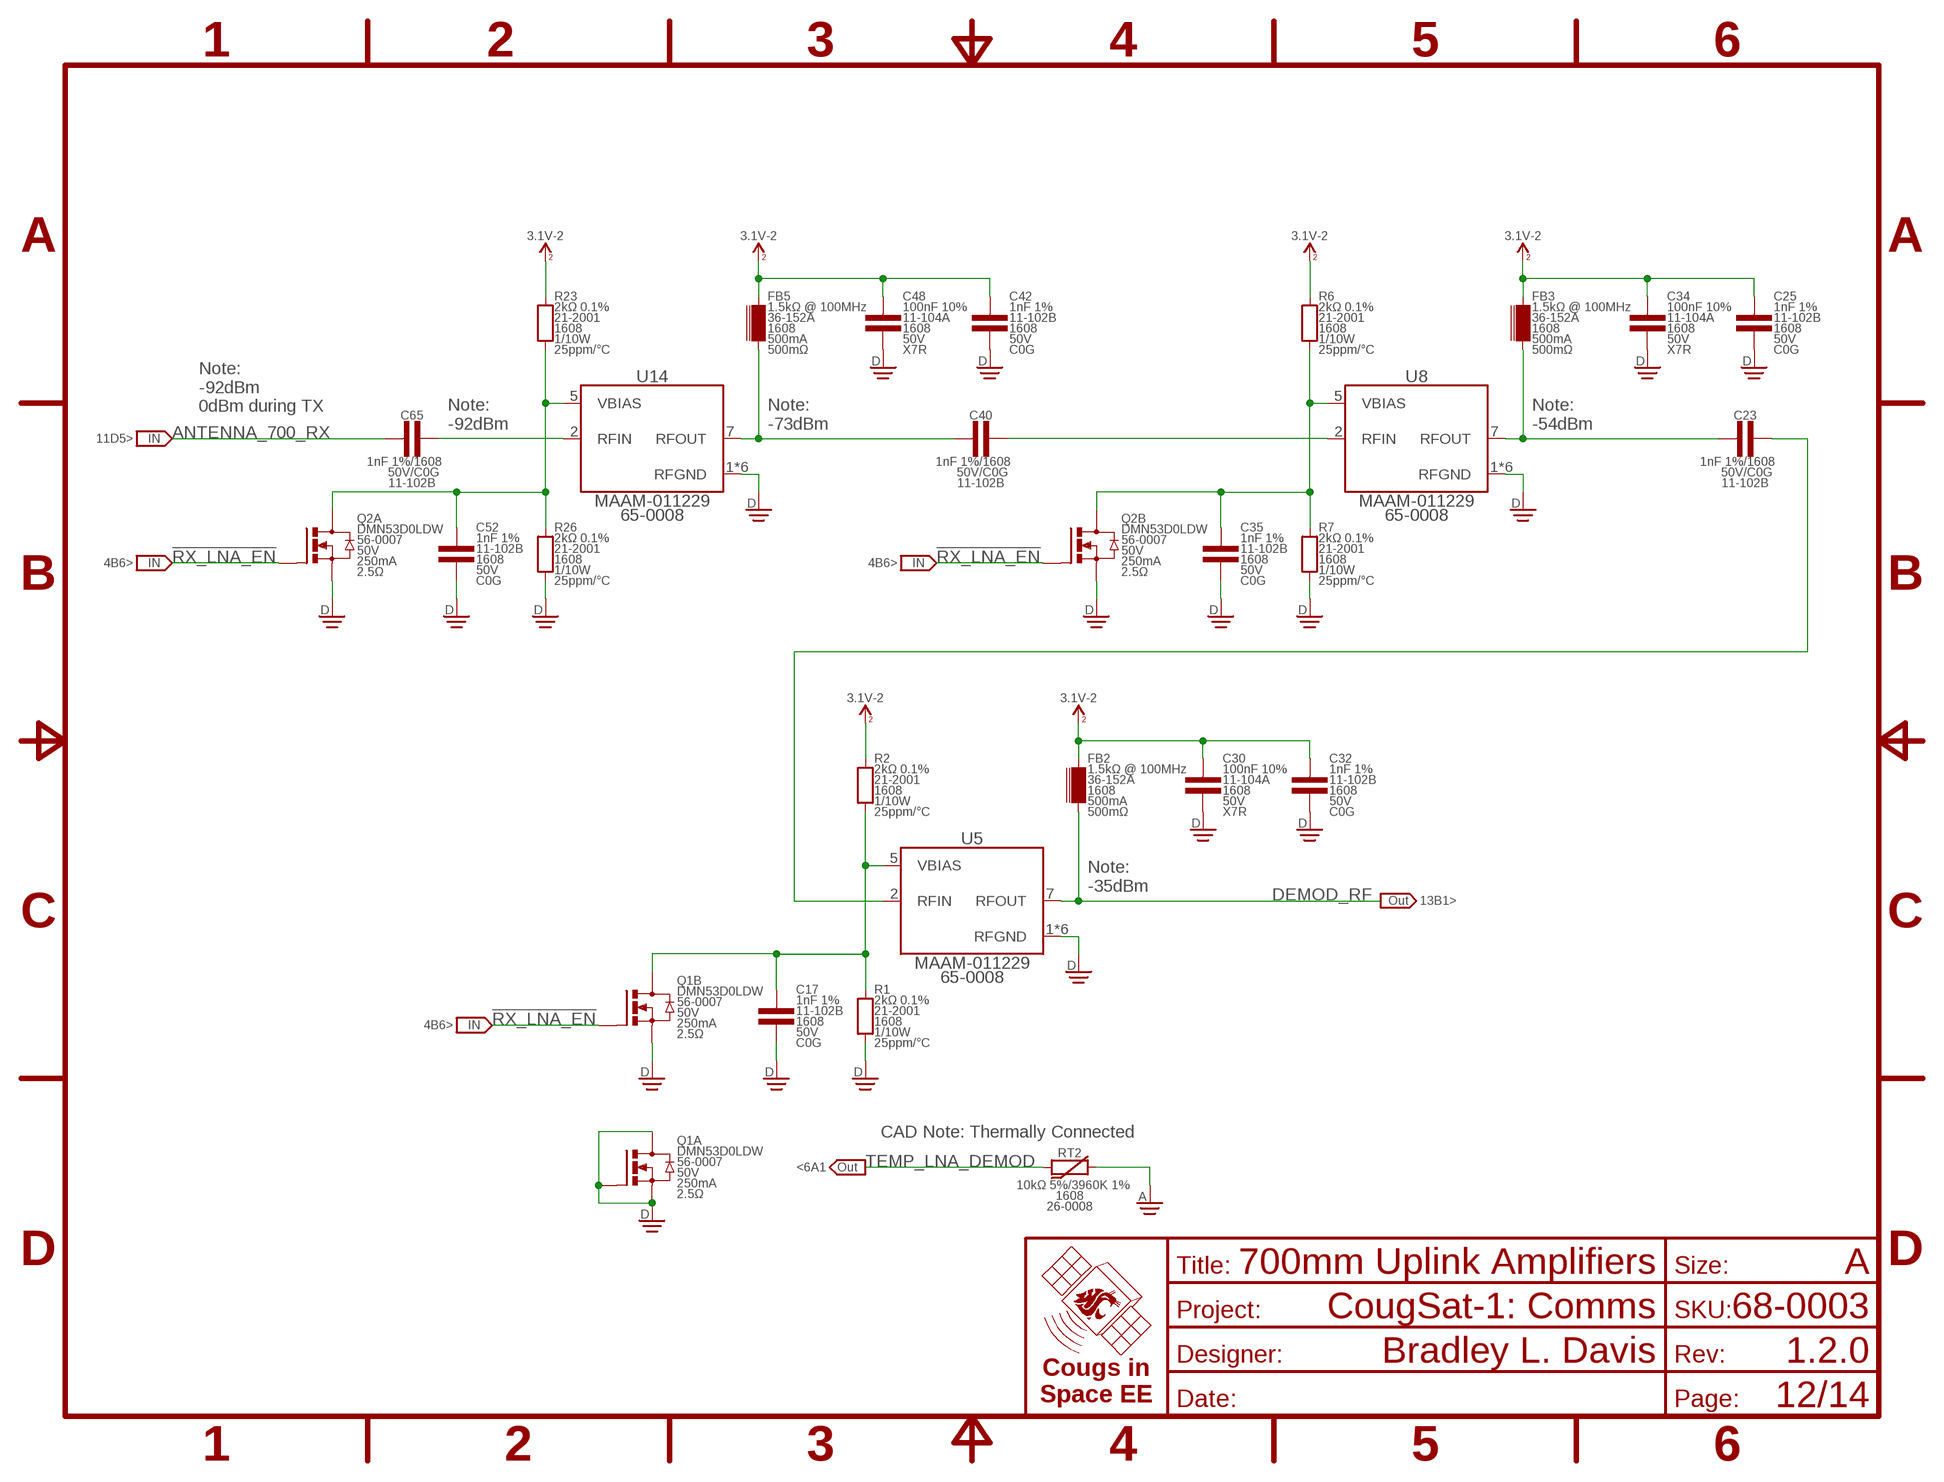
[diagram p11: schematic, sheet 12]
FRAME10 (FRAME-A): TITLE: 700mm Uplink Amplifiers

### Parts
C17  1nF 1%  CAP-V-1NF-B-1608  [1608]
C23  1nF 1%  CAP-H-1NF-B-1608  [1608]
C25  1nF 1%  CAP-V-1NF-B-1608  [1608]
C30  100nF 10%  CAP-V-100NF-1608  [1608]
C32  1nF 1%  CAP-V-1NF-B-1608  [1608]
C34  100nF 10%  CAP-V-100NF-1608  [1608]
C35  1nF 1%  CAP-V-1NF-B-1608  [1608]
C40  1nF 1%  CAP-H-1NF-B-1608  [1608]
C42  1nF 1%  CAP-V-1NF-B-1608  [1608]
C48  100nF 10%  CAP-V-100NF-1608  [1608]
C52  1nF 1%  CAP-V-1NF-B-1608  [1608]
C65  1nF 1%  CAP-H-1NF-B-1608  [1608]
FB2  1.5kΩ @ 100MHz  CHOKE-V-1.5K-1608  [1608]
FB3  1.5kΩ @ 100MHz  CHOKE-V-1.5K-1608  [1608]
FB5  1.5kΩ @ 100MHz  CHOKE-V-1.5K-1608  [1608]
Q1  DMN53D0LDW  MOSFET_DUAL-N-DMN53D0LDW-SOT363  [SOT363]
Q2  DMN53D0LDW  MOSFET_DUAL-N-DMN53D0LDW-SOT363  [SOT363]
R1  2kΩ 0.1%  RES-V-2K-1608  [1608]  (not fitted in variant Main)
R2  2kΩ 0.1%  RES-V-2K-1608  [1608]  (not fitted in variant Main)
R6  2kΩ 0.1%  RES-V-2K-1608  [1608]  (not fitted in variant Main)
R7  2kΩ 0.1%  RES-V-2K-1608  [1608]  (not fitted in variant Main)
R23  2kΩ 0.1%  RES-V-2K-1608  [1608]  (not fitted in variant Main)
R26  2kΩ 0.1%  RES-V-2K-1608  [1608]  (not fitted in variant Main)
RT2  10kΩ 5%  THERMISTOR-H-10K-1608  [1608]
U5  MAAM-011229  AMP-BIAS-MAAM-011229  [DFN-8-2020]
U8  MAAM-011229  AMP-BIAS-MAAM-011229  [DFN-8-2020]
U14  MAAM-011229  AMP-BIAS-MAAM-011229  [DFN-8-2020]

### Nets
3.1V_2 [Supplies]: C25.1 C30.1 C32.1 C34.1 C42.1 C48.1 FB2.2 FB3.2 FB5.2 R2.2 R6.2 R23.2 ; supply symbol labelled 3.1V-2 ; also sheet 8,10,13
!RX_LNA_EN: Q1.5(B:G) Q2.2(A:G) Q2.5(B:G) ; also sheet 4
AGND [AGND]: RT2.2 ; also sheet 3,4,6,7,8,9,10,11,13
ANTENNA_700_RX [50Ohm]: C65.1 ; also sheet 11
DEMOD_RF [50Ohm]: FB2.1 U5.7(RFOUT) ; also sheet 13
DGND [Supplies]: C17.2 C25.2 C30.2 C32.2 C34.2 C35.2 C42.2 C48.2 C52.2 Q1.1(A:S) Q1.2(A:G) Q1.4(B:S) Q1.6(A:D) Q2.1(A:S) Q2.4(B:S) R1.1 R7.1 R26.1 U5.1(RFGND) U5.3(RFGND) U5.4(RFGND) U5.6(RFGND) U5.8(RFGND) U5.PAD(RFGND) U8.1(RFGND) U8.3(RFGND) U8.4(RFGND) U8.6(RFGND) U8.8(RFGND) U8.PAD(RFGND) U14.1(RFGND) U14.3(RFGND) U14.4(RFGND) U14.6(RFGND) U14.8(RFGND) U14.PAD(RFGND) ; also sheet 3,4,5,6,7,8,9,10,11,13,14
RX_LNA_BIAS-0: C52.1 Q2.6(A:D) R23.1 R26.2 U14.5(VBIAS)
RX_LNA_BIAS-1: C35.1 Q2.3(B:D) R6.1 R7.2 U8.5(VBIAS)
RX_LNA_BIAS-2: C17.1 Q1.3(B:D) R1.2 R2.1 U5.5(VBIAS)
RX_LNA_RFIN-0 [50Ohm]: C65.2 U14.2(RFIN)
RX_LNA_RFIN-1 [50Ohm]: C40.2 U8.2(RFIN)
RX_LNA_RFIN-2 [50Ohm]: C23.2 U5.2(RFIN)
RX_LNA_RFOUT-0 [50Ohm]: C40.1 FB5.1 U14.7(RFOUT)
RX_LNA_RFOUT-1 [50Ohm]: C23.1 FB3.1 U8.7(RFOUT)
TEMP_LNA_DEMOD: RT2.1 ; also sheet 6

### Notes on the sheet
- Note:
  -92dBm
  0dBm during TX
- Note:
  -92dBm
- Note:
  -73dBm
- Note:
  -54dBm
- 11D5>
- 4B6> | 4B6>
- Note:
  -35dBm
- 13B1>
- 4B6>
- CAD Note: Thermally Connected
- <6A1

## Sheet 13 of 14
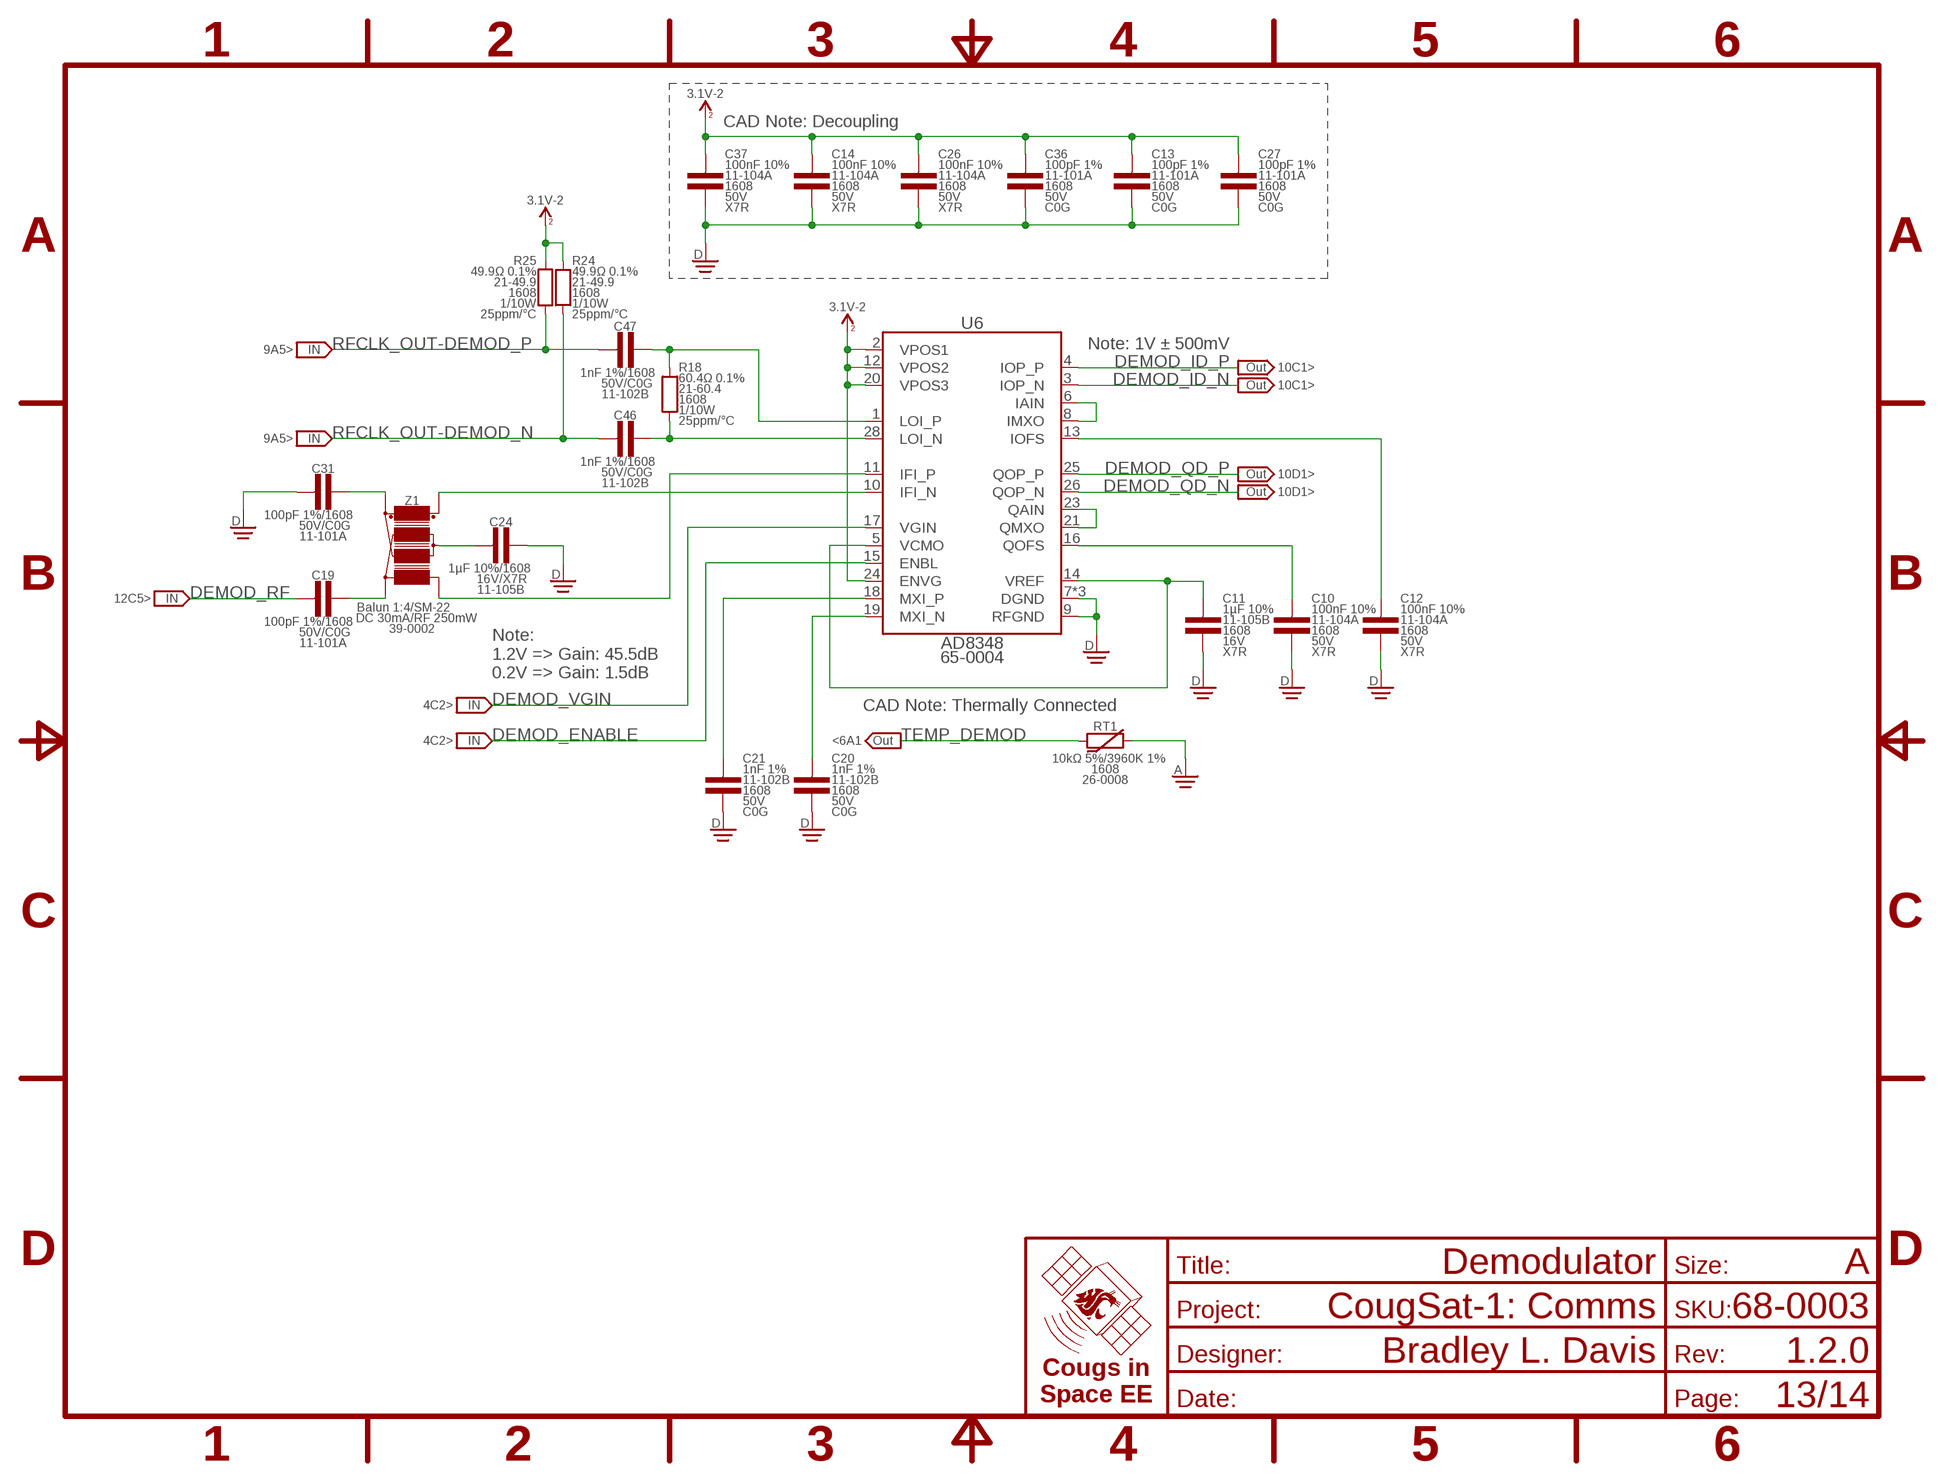
[diagram p12: schematic, sheet 13]
FRAME9 (FRAME-A): TITLE: Demodulator

### Parts
C10  100nF 10%  CAP-V-100NF-1608  [1608]
C11  1µF 10%  CAP-V-1UF-B-1608  [1608]
C12  100nF 10%  CAP-V-100NF-1608  [1608]
C13  100pF 1%  CAP-V-100PF-1608  [1608]
C14  100nF 10%  CAP-V-100NF-1608  [1608]
C19  100pF 1%  CAP-H-100PF-1608  [1608]
C20  1nF 1%  CAP-V-1NF-B-1608  [1608]
C21  1nF 1%  CAP-V-1NF-B-1608  [1608]
C24  1µF 10%  CAP-H-1UF-B-1608  [1608]
C26  100nF 10%  CAP-V-100NF-1608  [1608]
C27  100pF 1%  CAP-V-100PF-1608  [1608]
C31  100pF 1%  CAP-H-100PF-1608  [1608]
C36  100pF 1%  CAP-V-100PF-1608  [1608]
C37  100nF 10%  CAP-V-100NF-1608  [1608]
C46  1nF 1%  CAP-H-1NF-B-1608  [1608]
C47  1nF 1%  CAP-H-1NF-B-1608  [1608]
R18  60.4Ω 0.1%  RES-V-60.4R-1608  [1608]
R24  49.9Ω 0.1%  RES-V-49.9-1608  [1608]
R25  49.9Ω 0.1%  RES-V-49.9-1608  [1608]
RT1  10kΩ 5%  THERMISTOR-H-10K-1608  [1608]
U6  AD8348  [TSSOP-28]
Z1  Balun 1:4  BALUN-SCT-ETK42T-SM-22  [SM-22]

### Nets
3.1V_2 [Supplies]: C13.1 C14.1 C26.1 C27.1 C36.1 C37.1 R24.2 R25.2 U6.2(VPOS1) U6.12(VPOS2) U6.20(VPOS3) U6.24(ENVG) ; supply symbol labelled 3.1V-2 ; also sheet 8,10,12
AGND [AGND]: RT1.2 ; also sheet 3,4,6,7,8,9,10,11,12
DEMOD_700_BALUN_PRIMARY1 [200Ohm]: C31.2 Z1.5(PRIMARY-DOT)
DEMOD_700_BALUN_PRIMARY_DOT1 [50Ohm]: C19.2 Z1.4(PRIMARY)
DEMOD_700_BALUN_SCT [200Ohm]: C24.1 Z1.2(SECONDARY-CT)
DEMOD_700_IFI_N [200Ohm]: U6.11(IFI_P) Z1.3(SECONDARY)
DEMOD_700_IFI_P [200Ohm]: U6.10(IFI_N) Z1.1(SECONDARY-DOT)
DEMOD_700_LOI_N [50Ohm]: C46.2 R18.1 U6.28(LOI_N)
DEMOD_700_LOI_P [50Ohm]: C47.2 R18.2 U6.1(LOI_P)
DEMOD_ENABLE: U6.15(ENBL) ; also sheet 4
DEMOD_ID_N: U6.3(IOP_N) ; also sheet 10
DEMOD_ID_P: U6.4(IOP_P) ; also sheet 10
DEMOD_IMXO: U6.6(IAIN) U6.8(IMXO)
DEMOD_IOFS: C12.1 U6.13(IOFS)
DEMOD_MXI_N: C20.1 U6.19(MXI_N)
DEMOD_QD_N: U6.26(QOP_N) ; also sheet 10
DEMOD_QD_P: U6.25(QOP_P) ; also sheet 10
DEMOD_QMXO: U6.21(QMXO) U6.23(QAIN)
DEMOD_QOFS1: C10.1 U6.16(QOFS)
DEMOD_RF [50Ohm]: C19.1 ; also sheet 12
DEMOD_VGIN: U6.17(VGIN) ; also sheet 4
DEMOD_VREF: C11.1 U6.5(VCMO) U6.14(VREF)
DEMODE_MXI_P: C21.1 U6.18(MXI_P)
DGND [Supplies]: C10.2 C11.2 C12.2 C13.2 C14.2 C20.2 C21.2 C24.2 C26.2 C27.2 C31.1 C36.2 C37.2 U6.7(DGND) U6.9(RFGND) U6.22(DGND) U6.27(DGND) ; also sheet 3,4,5,6,7,8,9,10,11,12,14
RFCLK_OUT-DEMOD_N [50Ohm]: C46.1 R24.1 ; also sheet 10
RFCLK_OUT-DEMOD_P [50Ohm]: C47.1 R25.1 ; also sheet 10
TEMP_DEMOD: RT1.1 ; also sheet 6

### Notes on the sheet
- CAD Note: Decoupling
- 9A5> | Note: 1V ± 500mV
- 10C1>
- 10C1>
- 9A5>
- 10D1>
- 10D1>
- 12C5>
- Note:
  1.2V => Gain: 45.5dB
  0.2V => Gain: 1.5dB
- 4C2> | CAD Note: Thermally Connected
- 4C2> | <6A1

## Sheet 14 of 14
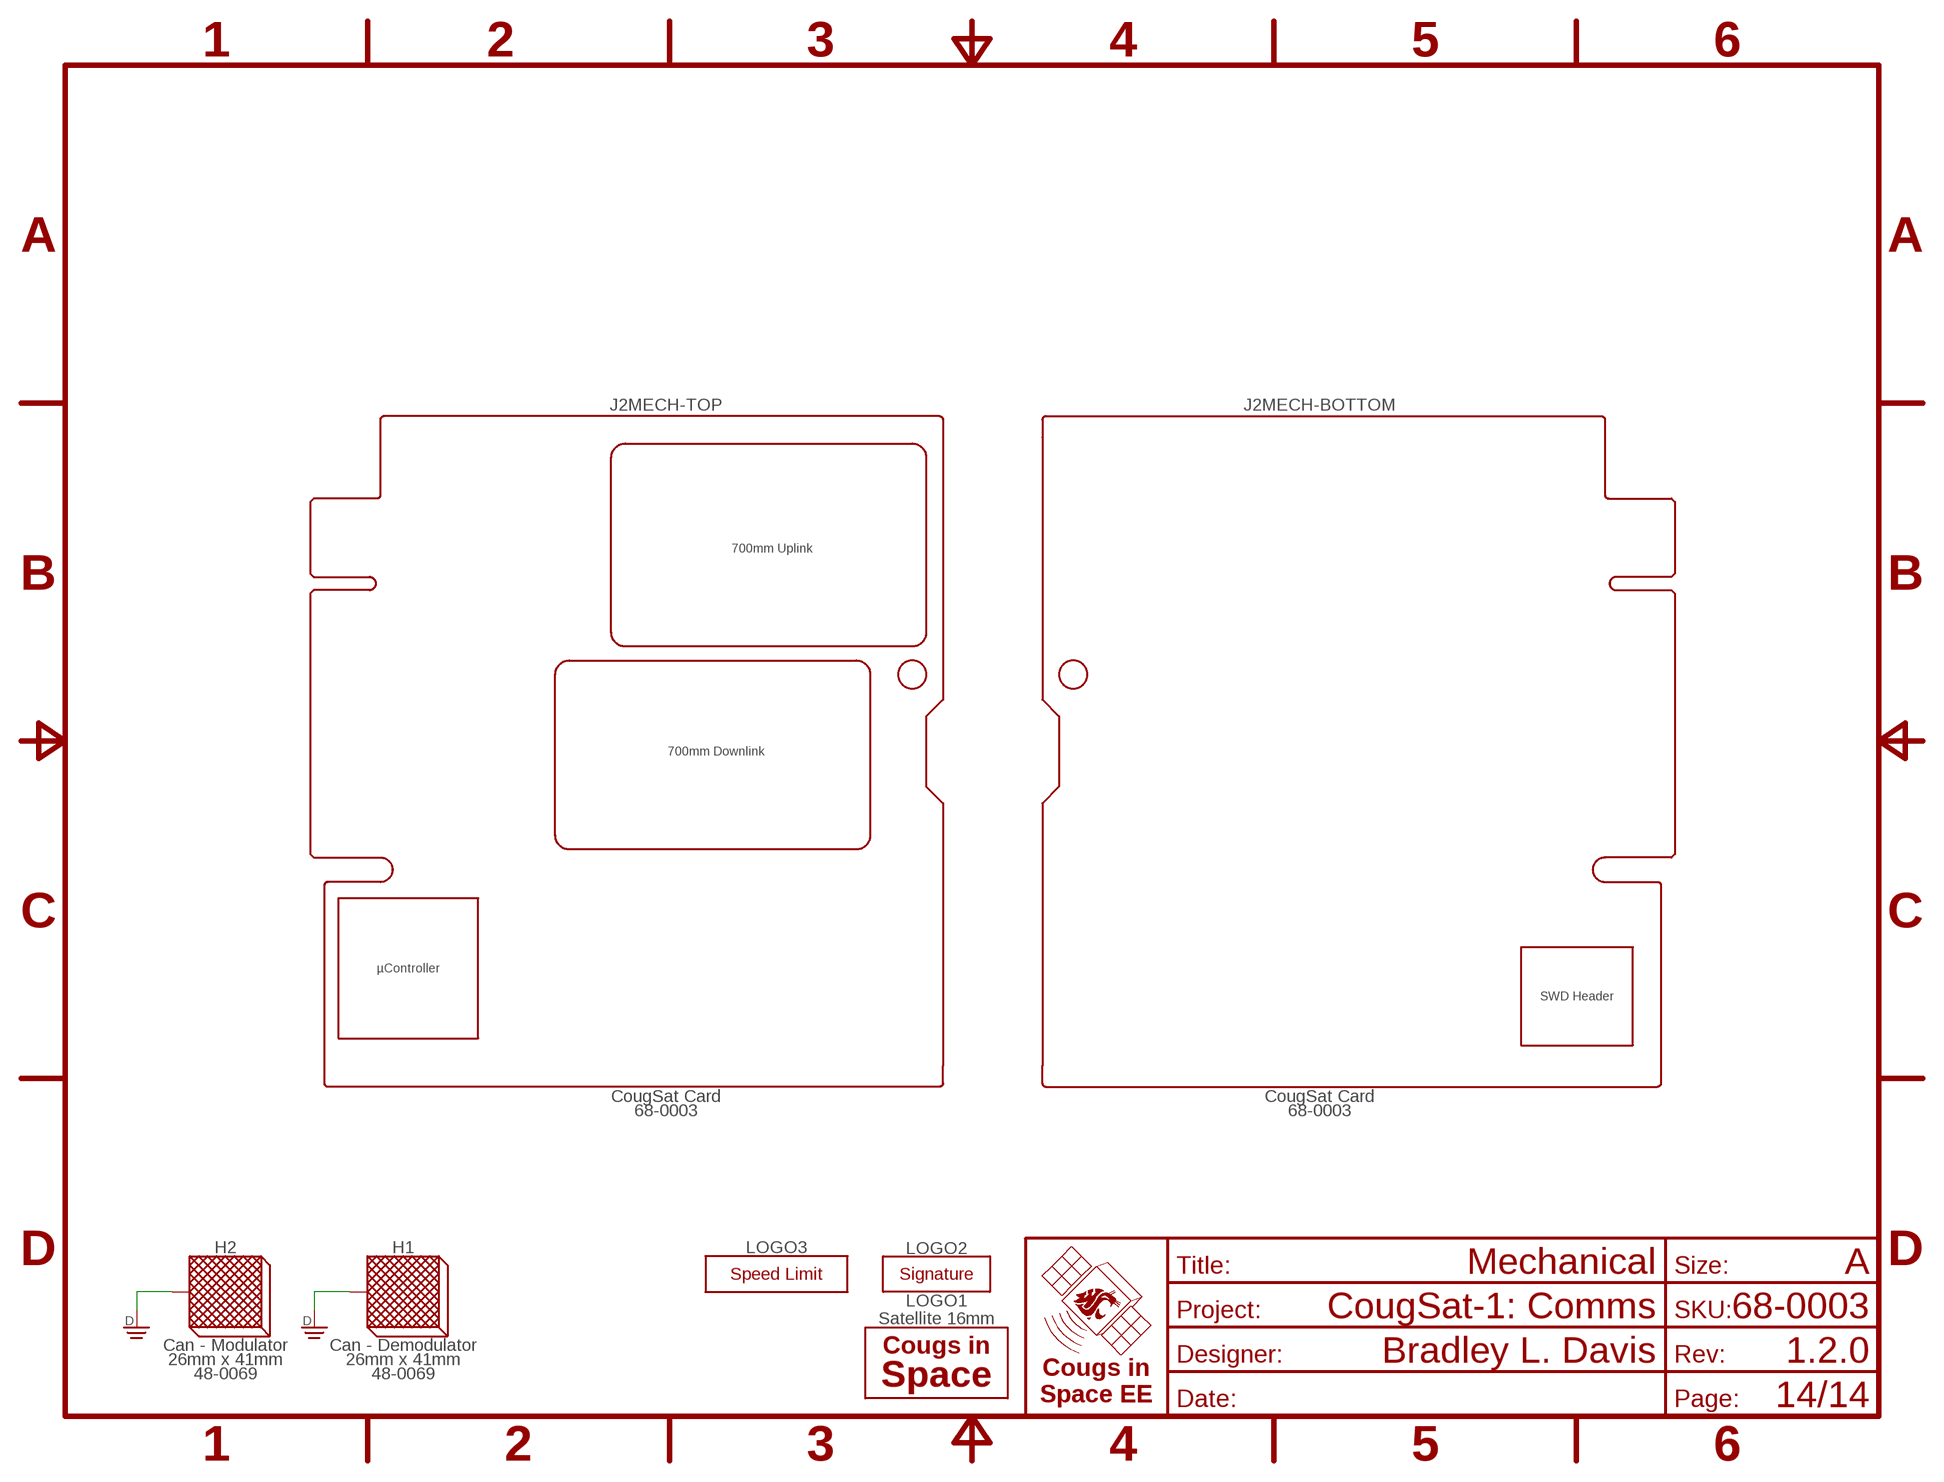
[diagram p13: schematic, sheet 14]
FRAME11 (FRAME-A): TITLE: Mechanical

### Parts
H1  Can - Demodulator  SHIELDING-2641  [SHIELD-2641]
H2  Can - Modulator  SHIELDING-2641  [SHIELD-2641]
LOGO1  Satellite 16mm  CIS-LOGO-SATELLITE-16MM  [CIS-SATELLITE-16]
LOGO2  SIGNATUREBRADLEY  [SIGN-BRADLEY]
LOGO3  Speed Limit  ARTWORK-SPEED_LIMIT  [SPEED_LIMIT]

### Nets
DGND [Supplies]: H1.1(SHIELD) H1.2(SHIELD) H2.1(SHIELD) H2.2(SHIELD) ; also sheet 3,4,5,6,7,8,9,10,11,12,13

### Notes on the sheet
- 700mm Uplink
- 700mm Downlink
- µController
- SWD Header

## Power pins joined to a net without a drawn wire
PR_3.3V-1: J2.A2(POWER:PR_3.3V-1) J2.B2(POWER:PR_3.3V-1)
PR_3.3V-2: J2.A3(POWER:PR_3.3V-2) J2.B3(POWER:PR_3.3V-2)
PR_3.3V-3: J2.A4(POWER:PR_3.3V-3) J2.B4(POWER:PR_3.3V-3)
PR_3.3V-4: J2.A5(POWER:PR_3.3V-4) J2.B5(POWER:PR_3.3V-4)
PR_3.3V-7: J2.A8(POWER:PR_3.3V-7) J2.B8(POWER:PR_3.3V-7)
PR_3.3V-8: J2.A9(POWER:PR_3.3V-8) J2.B9(POWER:PR_3.3V-8)
PR_3.3V-9: J2.A10(POWER:PR_3.3V-9) J2.B10(POWER:PR_3.3V-9)
PR_3.3V-10: J2.A11(POWER:PR_3.3V-10) J2.B11(POWER:PR_3.3V-10)
PR_3.3V-11: J2.A12(POWER:PR_3.3V-11) J2.B12(POWER:PR_3.3V-11)
PR_3.3V-12: J2.A13(POWER:PR_3.3V-12) J2.B13(POWER:PR_3.3V-12)
PR_BATT-0: J2.A14(POWER:PR_BATT-0) J2.B14(POWER:PR_BATT-0)
PR_BATT-1: J2.A15(POWER:PR_BATT-1) J2.B15(POWER:PR_BATT-1)
PR_BATT-2: J2.A16(POWER:PR_BATT-2) J2.B16(POWER:PR_BATT-2)
PR_BATT-3: J2.A17(POWER:PR_BATT-3) J2.B17(POWER:PR_BATT-3)
PR_BATT-4: J2.A18(POWER:PR_BATT-4) J2.B18(POWER:PR_BATT-4)
PR_BATT-5: J2.A19(POWER:PR_BATT-5) J2.B19(POWER:PR_BATT-5)